# EAGLE design Display_LED (EAGLE 9.6.2)
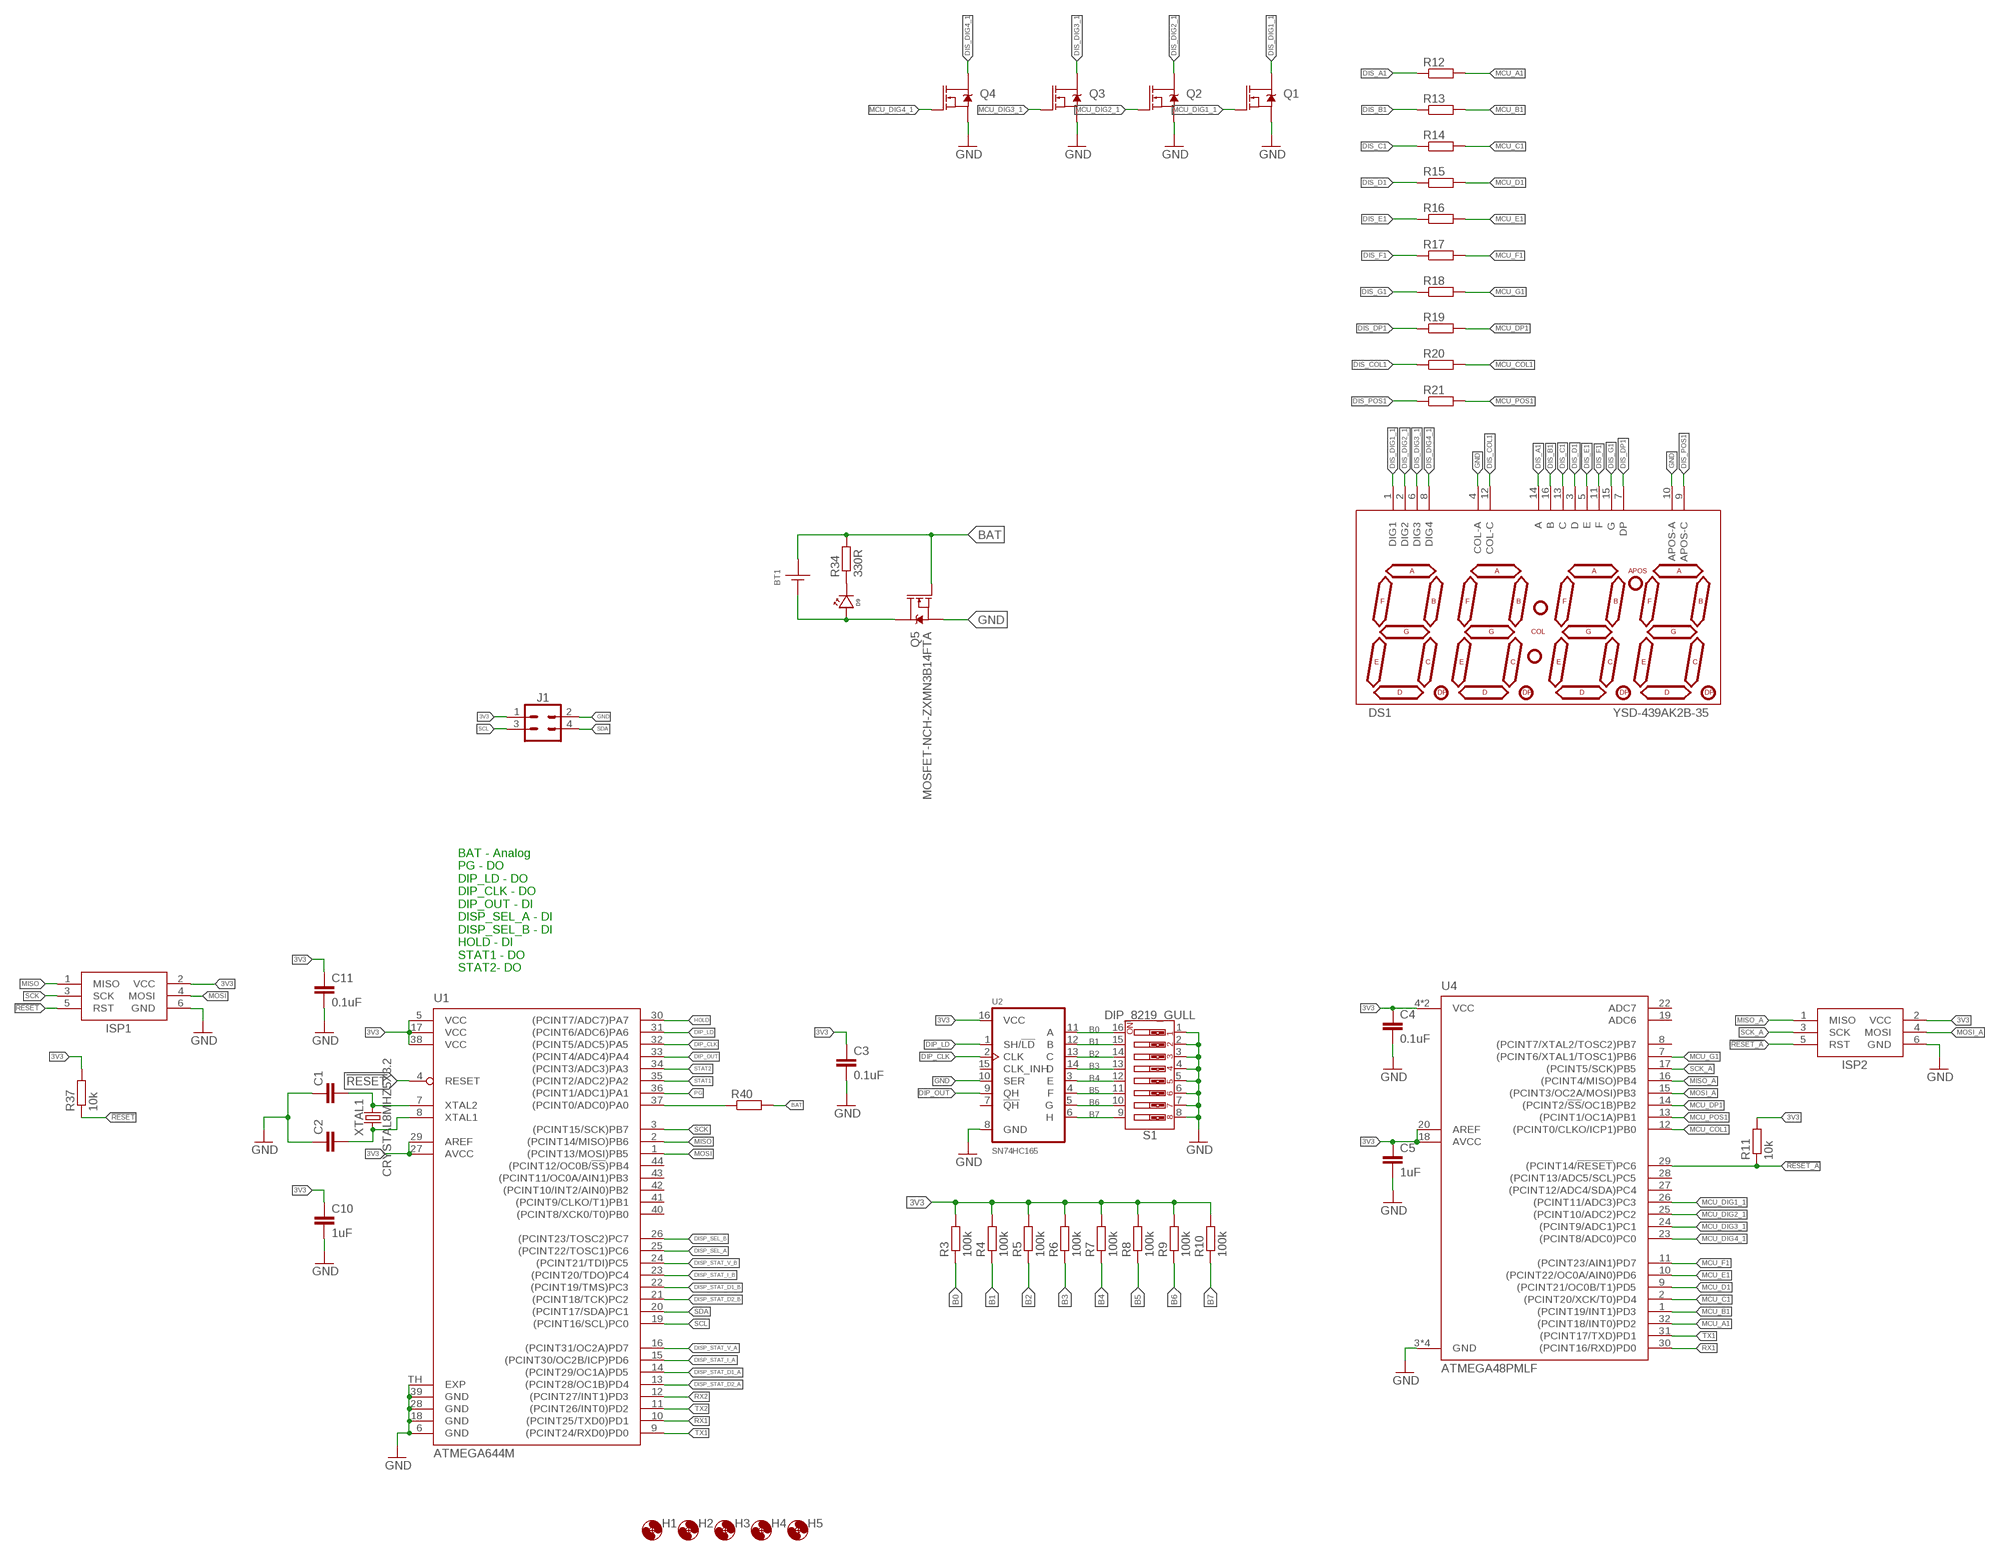
[diagram p0: schematic, sheet 1, part 1 of 2]
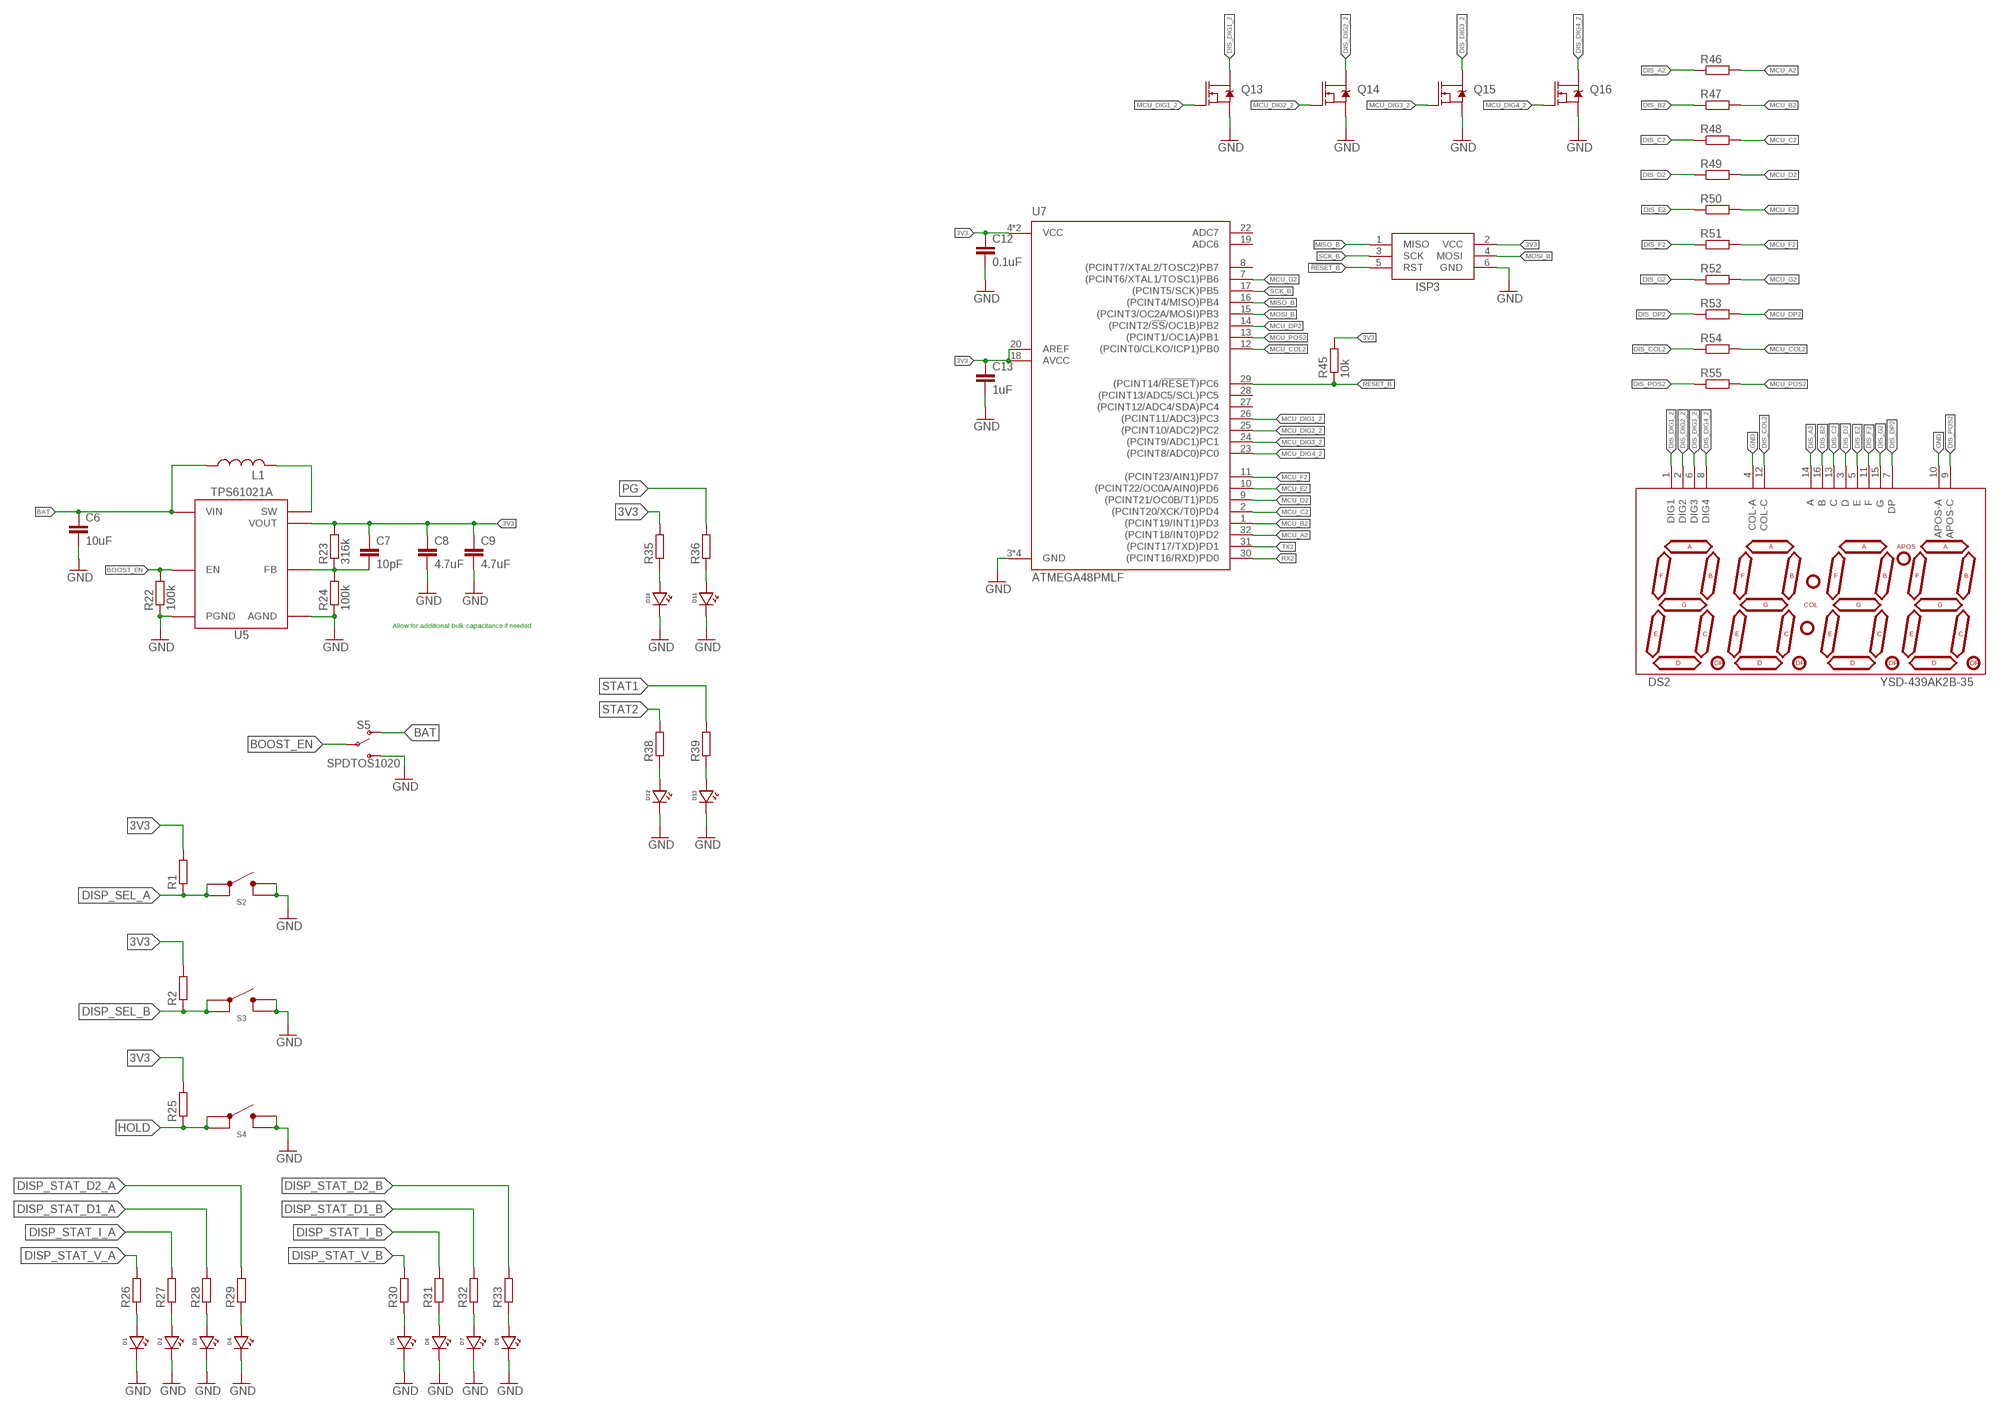
[diagram p1: schematic, sheet 1, part 2 of 2]

## Parts
BT1  AACLIP  [BAT_AA_BK-92]
C1  C-EU12PFC0402  [C0402]
C2  C-EU12PFC0402  [C0402]
C3  0.1uF  C-EU0.1UFC0603  [C0603]
C4  0.1uF  C-EU0.1UFC0603  [C0603]
C5  1uF  C-EU1UFC0603  [C0603]
C6  10uF  C-EU10UFC0805  [C0805]
C7  10pF  C-EU10PFC0603  [C0603]
C8  4.7uF  C-EU4.7UFC0805  [C0805]
C9  4.7uF  C-EU4.7UFC0805  [C0805]
C10  1uF  C-EU1UFC0603  [C0603]
C11  0.1uF  C-EU1UFC0603  [C0603]
C12  0.1uF  C-EU0.1UFC0603  [C0603]
C13  1uF  C-EU1UFC0603  [C0603]
D1  LED0603  [LED_0603]
D2  LED0603  [LED_0603]
D3  LED0603  [LED_0603]
D4  LED0603  [LED_0603]
D5  LED0603  [LED_0603]
D6  LED0603  [LED_0603]
D7  LED0603  [LED_0603]
D8  LED0603  [LED_0603]
D9  LED0603  [LED_0603]
D10  LED0603  [LED_0603]
D11  LED0603  [LED_0603]
D12  LED0603  [LED_0603]
D13  LED0603  [LED_0603]
DS1  YSD-439AK2B-35  LED_7-SEGMENT-4DIGIT-10MM-KGREEN  [7-SEGMENT-4DIGIT-YOUNGSUN]
DS2  YSD-439AK2B-35  LED_7-SEGMENT-4DIGIT-10MM-KGREEN  [7-SEGMENT-4DIGIT-YOUNGSUN]
H1  MOUNTING_HOLE2_NP  [2_56]
H2  MOUNTING_HOLE2_NP  [2_56]
H3  MOUNTING_HOLE2_NP  [2_56]
H4  MOUNTING_HOLE2_NP  [2_56]
H5  MOUNTING_HOLE2_NP  [2_56]
ISP1  AVRISP-6  [AVRISP]
ISP2  AVRISP-6  [AVRISP]
ISP3  AVRISP-6  [AVRISP]
J1  CONN_2X2MIRCOFIT_RT  [2X2_MICROFIT_RT]
L1  INDUCTORMAPI_3X3  [WE-MAPI(3X3)]
Q1  MOSFET-NCH-2N7002P  [SOT23-3]
Q2  MOSFET-NCH-2N7002P  [SOT23-3]
Q3  MOSFET-NCH-2N7002P  [SOT23-3]
Q4  MOSFET-NCH-2N7002P  [SOT23-3]
Q5  MOSFET-NCH-ZXMN3B14FTA  [SOT23-3]
Q13  MOSFET-NCH-2N7002P  [SOT23-3]
Q14  MOSFET-NCH-2N7002P  [SOT23-3]
Q15  MOSFET-NCH-2N7002P  [SOT23-3]
Q16  MOSFET-NCH-2N7002P  [SOT23-3]
R1  R-EU_10KR0603  [R0603]
R2  R-EU_10KR0603  [R0603]
R3  100k  R-EU_100KR0603  [R0603]
R4  100k  R-EU_100KR0603  [R0603]
R5  100k  R-EU_100KR0603  [R0603]
R6  100k  R-EU_100KR0603  [R0603]
R7  100k  R-EU_100KR0603  [R0603]
R8  100k  R-EU_100KR0603  [R0603]
R9  100k  R-EU_100KR0603  [R0603]
R10  100k  R-EU_100KR0603  [R0603]
R11  10k  R-EU_10KR0603  [R0603]
R12  R-EU_330R0603  [R0603]
R13  R-EU_330R0603  [R0603]
R14  R-EU_330R0603  [R0603]
R15  R-EU_330R0603  [R0603]
R16  R-EU_330R0603  [R0603]
R17  R-EU_330R0603  [R0603]
R18  R-EU_330R0603  [R0603]
R19  R-EU_330R0603  [R0603]
R20  R-EU_330R0603  [R0603]
R21  R-EU_330R0603  [R0603]
R22  100k  R-EU_100KR0603  [R0603]
R23  316k  R-EU_316KR0603  [R0603]
R24  100k  R-EU_100KR0603  [R0603]
R25  R-EU_10KR0603  [R0603]
R26  R-EU_330R0603  [R0603]
R27  R-EU_330R0603  [R0603]
R28  R-EU_330R0603  [R0603]
R29  R-EU_330R0603  [R0603]
R30  R-EU_330R0603  [R0603]
R31  R-EU_330R0603  [R0603]
R32  R-EU_330R0603  [R0603]
R33  R-EU_330R0603  [R0603]
R34  330R  R-EU_330R0603  [R0603]
R35  R-EU_330R0603  [R0603]
R36  R-EU_330R0603  [R0603]
R37  10k  R-EU_10KR0603  [R0603]
R38  R-EU_330R0603  [R0603]
R39  R-EU_330R0603  [R0603]
R40  R-EU_1KR0603  [R0603]
R45  10k  R-EU_10KR0603  [R0603]
R46  R-EU_330R0603  [R0603]
R47  R-EU_330R0603  [R0603]
R48  R-EU_330R0603  [R0603]
R49  R-EU_330R0603  [R0603]
R50  R-EU_330R0603  [R0603]
R51  R-EU_330R0603  [R0603]
R52  R-EU_330R0603  [R0603]
R53  R-EU_330R0603  [R0603]
R54  R-EU_330R0603  [R0603]
R55  R-EU_330R0603  [R0603]
S1  DIP_8219_GULL  [219-8_GULLWING_DIP-CTS]
S2  BUTTON6X6  [SWITCH_6MM]
S3  BUTTON6X6  [SWITCH_6MM]
S4  BUTTON6X6  [SWITCH_6MM]
S5  SPDTOS1020  [OS102011MS2QN1]
U1  ATMEGA644M  [MLF44-TH]
U2  SN74HC165PW  [TSSOP16]
U4  ATMEGA48PMLF  [MLF32-5X5]
U5  TPS61021A  [DSG0008A]
U7  ATMEGA48PMLF  [MLF32-5X5]
XTAL1  CRYSTAL8MHZ5X3.2  [CRYSTAL_5X3.2_2-SMD]

## Nets
3V3: C3.1 C4.1 C5.1 C7.1 C8.1 C9.1 C10.1 C11.1 C12.1 C13.1 ISP1.2(VCC) ISP2.2(VCC) ISP3.2(VCC) J1.1 R1.2 R2.2 R3.2 R4.2 R5.2 R6.2 R7.2 R8.2 R9.2 R10.2 R11.2 R23.2 R25.2 R35.2 R37.2 R45.2 U1.5(VCC) U1.17(VCC) U1.27(AVCC) U1.29(AREF) U1.38(VCC) U2.16(VCC) U4.4(VCC) U4.6(VCC) U4.18(AVCC) U4.20(AREF) U5.3(VOUT) U5.4(VOUT) U7.4(VCC) U7.6(VCC) U7.18(AVCC) U7.20(AREF)
!RESET: ISP1.5(RST) R37.1 U1.4(RESET)
!RESET_A: ISP2.5(RST) R11.1 U4.29((PCINT14/!RESET!)PC6)
!RESET_B: ISP3.5(RST) R45.1 U7.29((PCINT14/!RESET!)PC6)
B0: R3.1 S1.16 U2.11(A)
B1: R4.1 S1.15 U2.12(B)
B2: R5.1 S1.14 U2.13(C)
B3: R6.1 S1.13 U2.14(D)
B4: R7.1 S1.12 U2.3(E)
B5: R8.1 S1.11 U2.4(F)
B6: R9.1 S1.10 U2.5(G)
B7: R10.1 S1.9 U2.6(H)
BAT: BT1.POS@1(+) BT1.POS@2(+) C6.1 L1.P$1 Q5.1(G) R34.2 R40.2 S5.1(O) U5.8(VIN)
BAT_SENSE: R40.1 U1.37((PCINT0/ADC0)PA0)
BOOST_EN: R22.2 S5.2(P) U5.5(EN)
DIP_CLK: U1.32((PCINT5/ADC5)PA5) U2.2(CLK)
DIP_LD: U1.31((PCINT6/ADC6)PA6) U2.1(SH/!LD)
DIP_OUT: U1.33((PCINT4/ADC4)PA4) U2.9(QH)
DIS_A1: DS1.14(A) R12.1
DIS_A2: DS2.14(A) R46.1
DIS_B1: DS1.16(B) R13.1
DIS_B2: DS2.16(B) R47.1
DIS_C1: DS1.13(C) R14.1
DIS_C2: DS2.13(C) R48.1
DIS_COL1: DS1.12(COL-C) R20.1
DIS_COL2: DS2.12(COL-C) R54.1
DIS_D1: DS1.3(D) R15.1
DIS_D2: DS2.3(D) R49.1
DIS_DIG1_1: DS1.1(DIG1) Q1.3(D)
DIS_DIG1_2: DS2.1(DIG1) Q13.3(D)
DIS_DIG2_1: DS1.2(DIG2) Q2.3(D)
DIS_DIG2_2: DS2.2(DIG2) Q14.3(D)
DIS_DIG3_1: DS1.6(DIG3) Q3.3(D)
DIS_DIG3_2: DS2.6(DIG3) Q15.3(D)
DIS_DIG4_1: DS1.8(DIG4) Q4.3(D)
DIS_DIG4_2: DS2.8(DIG4) Q16.3(D)
DIS_DP1: DS1.7(DP) R19.1
DIS_DP2: DS2.7(DP) R53.1
DIS_E1: DS1.5(E) R16.1
DIS_E2: DS2.5(E) R50.1
DIS_F1: DS1.11(F) R17.1
DIS_F2: DS2.11(F) R51.1
DIS_G1: DS1.15(G) R18.1
DIS_G2: DS2.15(G) R52.1
DIS_POS1: DS1.9(APOS-C) R21.1
DIS_POS2: DS2.9(APOS-C) R55.1
DISP_SEL_A: R1.1 S2.1 S2.2 U1.25((PCINT22/TOSC1)PC6)
DISP_SEL_B: R2.1 S3.1 S3.2 U1.26((PCINT23/TOSC2)PC7)
DISP_STAT_D1_A: R28.2 U1.14((PCINT29/OC1A)PD5)
DISP_STAT_D1_B: R32.2 U1.22((PCINT19/TMS)PC3)
DISP_STAT_D2_A: R29.2 U1.13((PCINT28/OC1B)PD4)
DISP_STAT_D2_B: R33.2 U1.21((PCINT18/TCK)PC2)
DISP_STAT_I_A: R27.2 U1.15((PCINT30/OC2B/ICP)PD6)
DISP_STAT_I_B: R31.2 U1.23((PCINT20/TDO)PC4)
DISP_STAT_V_A: R26.2 U1.16((PCINT31/OC2A)PD7)
DISP_STAT_V_B: R30.2 U1.24((PCINT21/TDI)PC5)
FB: C7.2 R23.1 R24.2 U5.2(FB)
GND: C1.1 C2.1 C3.2 C4.2 C5.2 C6.2 C8.2 C9.2 C10.2 C11.2 C12.2 C13.2 D1.CATHODE D2.CATHODE D3.CATHODE D4.CATHODE D5.CATHODE D6.CATHODE D7.CATHODE D8.CATHODE D10.CATHODE D11.CATHODE D12.CATHODE D13.CATHODE DS1.4(COL-A) DS1.10(APOS-A) DS2.4(COL-A) DS2.10(APOS-A) ISP1.6(GND) ISP2.6(GND) ISP3.6(GND) J1.2 Q1.2(S) Q2.2(S) Q3.2(S) Q4.2(S) Q5.2(S) Q13.2(S) Q14.2(S) Q15.2(S) Q16.2(S) R22.1 R24.1 S1.1 S1.2 S1.3 S1.4 S1.5 S1.6 S1.7 S1.8 S2.3 S2.4 S3.3 S3.4 S4.3 S4.4 S5.3(S) U1.6(GND) U1.18(GND) U1.28(GND) U1.39(GND) U1.TH(EXP) U2.8(GND) U2.10(SER) U4.3(GND) U4.5(GND) U4.21(GND) U4.TH(GND) U5.1(AGND) U5.EP@1(PGND) U5.EP@2(PGND) U5.EP@3(PGND) U7.3(GND) U7.5(GND) U7.21(GND) U7.TH(GND)
HOLD: R25.1 S4.1 S4.2 U1.30((PCINT7/ADC7)PA7)
MCU_A1: R12.2 U4.32((PCINT18/INT0)PD2)
MCU_A2: R46.2 U7.32((PCINT18/INT0)PD2)
MCU_B1: R13.2 U4.1((PCINT19/INT1)PD3)
MCU_B2: R47.2 U7.1((PCINT19/INT1)PD3)
MCU_C1: R14.2 U4.2((PCINT20/XCK/T0)PD4)
MCU_C2: R48.2 U7.2((PCINT20/XCK/T0)PD4)
MCU_COL1: R20.2 U4.12((PCINT0/CLKO/ICP1)PB0)
MCU_COL2: R54.2 U7.12((PCINT0/CLKO/ICP1)PB0)
MCU_D1: R15.2 U4.9((PCINT21/OC0B/T1)PD5)
MCU_D2: R49.2 U7.9((PCINT21/OC0B/T1)PD5)
MCU_DIG1_1: Q1.1(G) U4.26((PCINT11/ADC3)PC3)
MCU_DIG1_2: Q13.1(G) U7.26((PCINT11/ADC3)PC3)
MCU_DIG2_1: Q2.1(G) U4.25((PCINT10/ADC2)PC2)
MCU_DIG2_2: Q14.1(G) U7.25((PCINT10/ADC2)PC2)
MCU_DIG3_1: Q3.1(G) U4.24((PCINT9/ADC1)PC1)
MCU_DIG3_2: Q15.1(G) U7.24((PCINT9/ADC1)PC1)
MCU_DIG4_1: Q4.1(G) U4.23((PCINT8/ADC0)PC0)
MCU_DIG4_2: Q16.1(G) U7.23((PCINT8/ADC0)PC0)
MCU_DP1: R19.2 U4.14((PCINT2/!SS!/OC1B)PB2)
MCU_DP2: R53.2 U7.14((PCINT2/!SS!/OC1B)PB2)
MCU_E1: R16.2 U4.10((PCINT22/OC0A/AIN0)PD6)
MCU_E2: R50.2 U7.10((PCINT22/OC0A/AIN0)PD6)
MCU_F1: R17.2 U4.11((PCINT23/AIN1)PD7)
MCU_F2: R51.2 U7.11((PCINT23/AIN1)PD7)
MCU_G1: R18.2 U4.7((PCINT6/XTAL1/TOSC1)PB6)
MCU_G2: R52.2 U7.7((PCINT6/XTAL1/TOSC1)PB6)
MCU_POS1: R21.2 U4.13((PCINT1/OC1A)PB1)
MCU_POS2: R55.2 U7.13((PCINT1/OC1A)PB1)
MISO: ISP1.1(MISO) U1.2((PCINT14/MISO)PB6)
MISO_A: ISP2.1(MISO) U4.16((PCINT4/MISO)PB4)
MISO_B: ISP3.1(MISO) U7.16((PCINT4/MISO)PB4)
MOSI: ISP1.4(MOSI) U1.1((PCINT13/MOSI)PB5)
MOSI_A: ISP2.4(MOSI) U4.15((PCINT3/OC2A/MOSI)PB3)
MOSI_B: ISP3.4(MOSI) U7.15((PCINT3/OC2A/MOSI)PB3)
N$1: D1.ANODE R26.1
N$2: D2.ANODE R27.1
N$3: D3.ANODE R28.1
N$4: D4.ANODE R29.1
N$5: D5.ANODE R30.1
N$6: D6.ANODE R31.1
N$7: D7.ANODE R32.1
N$8: D8.ANODE R33.1
N$9: D10.ANODE R35.1
N$10: BT1.NEG@1(-) BT1.NEG@2(-) D9.ANODE Q5.3(D)
N$11: D9.CATHODE R34.1
N$12: D12.ANODE R38.1
N$13: C2.2 U1.8(XTAL1) XTAL1.OSC1
N$14: D11.ANODE R36.1
N$15: C1.2 U1.7(XTAL2) XTAL1.OSC2
N$16: D13.ANODE R39.1
PG: R36.2 U1.36((PCINT1/ADC1)PA1)
RX1: U1.10((PCINT25/TXD0)PD1) U4.30((PCINT16/RXD)PD0)
RX2: U1.12((PCINT27/INT1)PD3) U7.30((PCINT16/RXD)PD0)
SCK: ISP1.3(SCK) U1.3((PCINT15/SCK)PB7)
SCK_A: ISP2.3(SCK) U4.17((PCINT5/SCK)PB5)
SCK_B: ISP3.3(SCK) U7.17((PCINT5/SCK)PB5)
SCL: J1.3 U1.19((PCINT16/SCL)PC0)
SDA: J1.4 U1.20((PCINT17/SDA)PC1)
STAT1: R39.2 U1.35((PCINT2/ADC2)PA2)
STAT2: R38.2 U1.34((PCINT3/ADC3)PA3)
SW: L1.P$2 U5.6(SW) U5.7(SW)
TX1: U1.9((PCINT24/RXD0)PD0) U4.31((PCINT17/TXD)PD1)
TX2: U1.11((PCINT26/INT0)PD2) U7.31((PCINT17/TXD)PD1)
Unconnected: U1.40((PCINT8/XCK0/T0)PB0) U1.41((PCINT9/CLKO/T1)PB1) U1.42((PCINT10/INT2/AIN0)PB2) U1.43((PCINT11/OC0A/AIN1)PB3) U1.44((PCINT12/OC0B/!SS!)PB4) U2.7(!QH) U2.15(CLK_INH) U4.8((PCINT7/XTAL2/TOSC2)PB7) U4.19(ADC6) U4.22(ADC7) U4.27((PCINT12/ADC4/SDA)PC4) U4.28((PCINT13/ADC5/SCL)PC5) U7.8((PCINT7/XTAL2/TOSC2)PB7) U7.19(ADC6) U7.22(ADC7) U7.27((PCINT12/ADC4/SDA)PC4) U7.28((PCINT13/ADC5/SCL)PC5)

## Notes on the sheet
- Allow for additional bulk capacitance if needed
- BAT - Analog
  PG - DO
  DIP_LD - DO
  DIP_CLK - DO
  DIP_OUT - DI
  DISP_SEL_A - DI
  DISP_SEL_B - DI
  HOLD - DI
  STAT1 - DO
  STAT2- DO

## Library data of the parts
BT1 = bschulz:AA: AA Battery Holder/Contact; DIGIKEY: BK-92-ND; MF: MPD; MPN: BK-92
C1 C2 = bschulz_passives:C-EU: CAPACITOR, European symbol; DIGIKEY: 445-5585-1-ND; MF: TDK; MPN: CGA2B2C0G1H120J050BA
C3 C4 C12 = bschulz_passives:C-EU: CAPACITOR, European symbol; DIGIKEY: 490-6051-1-ND; MF: Murata; MPN: GCM188R71E104KA57D
C5 C10 C11 C13 = bschulz_passives:C-EU: CAPACITOR, European symbol; DIGIKEY: 587-1251-1-ND; MF: Yaiyo Yuden; MPN: EMK107BJ105KA-T
C6 = bschulz_passives:C-EU: CAPACITOR, European symbol; DIGIKEY: 490-6473-6-ND; MF: Murata; MPN: GRM21BR61C106KE15K
C7 = bschulz_passives:C-EU: CAPACITOR, European symbol; DIGIKEY: 311-1058-1-ND; MF: Yageo; MPN: CC0603JRNPO9BN100CC0603JRNPO9BN100
C8 C9 = bschulz_passives:C-EU: CAPACITOR, European symbol; DIGIKEY: 399-7415-1-ND; MF: Kemet; MPN: C0805C475K4RACTU
D1-D13 = bschulz:LED: Genaric LED
DS1 DS2 = bschulz:LED_7-SEGMENT-4DIGIT-10MM: 4 Digit 7 Segment Display This is a part for the 4-Digit 7-segment LEDs from Young Sun. Different from the Digikey LEDs, all 16 pins are used. The LONGPADS Variant is used for a test jig, but you may like it because there is more pad to solder to. If you are concerned about routing space, the standard works just fine though. Datasheets: Red <http://www.sparkfun.com/datasheets/Components/LED/7-Segment/YSD-439AR6B-35.pdf> Yellow <http://www.sparkfun.com/datasheets/Components/LED/7-Segment/YSD-439AY2B-35.pdf> Kelly Green <http://www.sparkfun.com/datasheets/Components/LED/7-Segment/YSD-439AK2B-35.pdf> Blue <http://www.sparkfun.com/datasheets/Components/LED/7-Segment/YSD-439AB4B-35.pdf> White <http://cdn.sparkfun.com/datasheets/Components/LED/ATA3492BW_2.pdf> SparkFun Products Raw Components 7-Segment Display - 4-Digit (Red) <https://www.sparkfun.com/products/9483> (COM-09483) 7-Segment Display - 4-Digit (Yellow) <https://www.sparkfun.com/products/9480> (COM-09480) 7-Segment Display - 4-Digit (Kelly Green) <https://www.sparkfun.com/products/9482> (COM-09482) 7-Segment Display - 4-Digit (Blue) <https://www.sparkfun.com/products/9481> (COM-09481) 7-Segment Display - 4-Digit (White) <https://www.sparkfun.com/products/10931> ( COM-10931) Serial Controlled SparkFun 7-Segment Serial Display - Red <https://www.sparkfun.com/products/11441> (COM-11441) SparkFun 7-Segment Serial Display - Yellow <https://www.sparkfun.com/products/11443> (COM-11443) SparkFun 7-Segment Serial Display - Kelly Green <https://www.sparkfun.com/products/11440> (COM-11440) SparkFun 7-Segment Serial Display - Blue <https://www.sparkfun.com/products/11442> (COM-11442) SparkFun 7-Segment Serial Display - White <https://www.sparkfun.com/products/11629> (COM-11629) Other SparkFun BigTime Watch Kit <https://www.sparkfun.com/products/11734> (KIT-11734); PROD_ID: COMP-09665
H1-H5 = bschulz:MOUNTING_HOLE: Genaric Mechanical Mounting Hole Hole diameter based on max body diameter + 15% Keepout ring is for diameter of socket cap screw (minimum required clearance) TPlace ring is for diameter of pan head screw (recomended clearance) Specifications: Socket Cap <http://fastener-express.com/fastener-technical/SocketscapSS-Alloy.pdf> Button Head Socket Cap <http://fastener-express.com/fastener-technical/Button-Socket-alloy.pdf> Pan Head <http://fastener-express.com/fastener-technical/pan-machine-Screws.pdf>; DIGIKEY: DNP; MF: N/A; MPN: DNP
ISP1-ISP3 = bschulz:AVRISP: AVR ISP HEADER Standard 6 pin header for AVR programming
J1 = bschulz:CONN_2X2: Genaric 2x2 terminal header; DIGIKEY: WM1814-ND; MF: Molex; MPN: 0430450400
L1 = bschulz:INDUCTOR: Genaric inductor
Q1-Q4 Q13-Q16 = bschulz:MOSFET-NCH: N-channel MOSFETs Voltage controlled devices that allow control of high current outputs. SparkFun Products: SparkFun OpenScale <https://www.sparkfun.com/products/13261> SparkFun Digital Sandbox <https://www.sparkfun.com/products/12651> SparkFun Monster Moto Shield <https://www.sparkfun.com/products/10182> SparkFun MOSFET Power Controller <https://www.sparkfun.com/products/11214>; DIGIKEY: 1727-4692-1-ND; MF: Nexperia; MPN: 2N7002P,215
Q5 = bschulz:MOSFET-NCH: N-channel MOSFETs Voltage controlled devices that allow control of high current outputs. SparkFun Products: SparkFun OpenScale <https://www.sparkfun.com/products/13261> SparkFun Digital Sandbox <https://www.sparkfun.com/products/12651> SparkFun Monster Moto Shield <https://www.sparkfun.com/products/10182> SparkFun MOSFET Power Controller <https://www.sparkfun.com/products/11214>; DIGIKEY: ZXMN3B14FCT-ND; MF: Diodes Inc; MPN: ZXMN3B14FTA
R1 R2 R11 R25 R37 R45 = bschulz_passives:R-EU_: RESISTOR, European symbol Digikey Parts: Yageo, 0402 <https://www.digikey.com/products/en/resistors/chip-resistor-surface-mount/52?k=&pkeyword=&sv=0&s=4356&sf=1&FV=-1%7C13%2C7%7C2%2C1291%7C39157%2C1989%7C0%2C-8%7C52%2C3%7C1131%2C3%7C2503&quantity=&ColumnSort=0&page=1&stock=1&pageSize=25> Yageo, 0603 <https://www.digikey.com/products/en/resistors/chip-resistor-surface-mount/52?k=&pkeyword=&sv=0&pv1291=39245&sf=1&FV=-5%7C4356%2C-5%7C47360%2C-8%7C52%2C-1%7C13%2C7%7C2%2C1989%7C0&quantity=10&ColumnSort=1000011&page=1&stock=1&pageSize=25> Panasonic, 0603 <https://www.digikey.com/products/en/resistors/chip-resistor-surface-mount/52?k=&pkeyword=&pv252=68&sf=0&FV=ffec373d%2C1c0002%2C142c040c%2C1f140000%2Cffe00034%2C80002%2Cc0001&quantity=&ColumnSort=0&page=1&stock=1&pageSize=25> Panasonic, precision, 0603 <https://www.digikey.com/products/en/resistors/chip-resistor-surface-mount/52?FV=ffec4907%2Cfffc000a%2Cc0172%2C142c040c%2C1f140000%2Cffe00034%2C1c0002&quantity=100&ColumnSort=2085&page=1&stock=1&pageSize=25> Panasonic, 0805 <https://www.digikey.com/products/en/resistors/chip-resistor-surface-mount/52?k=&pkeyword=&pv3=1&sf=0&FV=ffec373d%2C1c0002%2C1f140000%2Cffe00034%2C142c040d&quantity=&ColumnSort=0&page=1&stock=1&pageSize=25> Rohm, current sense <https://www.digikey.com/products/en/resistors/chip-resistor-surface-mount/52?k=&pkeyword=&pv3=1&sf=0&FV=ffecb688%2C1f140000%2Cffe00034%2C1c0002&quantity=&ColumnSort=0&page=1&stock=1&pageSize=25> Vishay, pulse proof automotive <https://www.digikey.com/products/en/resistors/chip-resistor-surface-mount/52?k=&pkeyword=&pv7=2&sf=0&FV=ffec5d6b%2Cffe00034%2C1f140000&quantity=&ColumnSort=0&page=1&stock=1&pageSize=25>; DIGIKEY: 311-10.0KHRCT-ND; MF: Yageo; MPN: RC0603FR-0710KL; VALUE_PART: 10k
R3-R10 R22 R24 = bschulz_passives:R-EU_: RESISTOR, European symbol Digikey Parts: Yageo, 0402 <https://www.digikey.com/products/en/resistors/chip-resistor-surface-mount/52?k=&pkeyword=&sv=0&s=4356&sf=1&FV=-1%7C13%2C7%7C2%2C1291%7C39157%2C1989%7C0%2C-8%7C52%2C3%7C1131%2C3%7C2503&quantity=&ColumnSort=0&page=1&stock=1&pageSize=25> Yageo, 0603 <https://www.digikey.com/products/en/resistors/chip-resistor-surface-mount/52?k=&pkeyword=&sv=0&pv1291=39245&sf=1&FV=-5%7C4356%2C-5%7C47360%2C-8%7C52%2C-1%7C13%2C7%7C2%2C1989%7C0&quantity=10&ColumnSort=1000011&page=1&stock=1&pageSize=25> Panasonic, 0603 <https://www.digikey.com/products/en/resistors/chip-resistor-surface-mount/52?k=&pkeyword=&pv252=68&sf=0&FV=ffec373d%2C1c0002%2C142c040c%2C1f140000%2Cffe00034%2C80002%2Cc0001&quantity=&ColumnSort=0&page=1&stock=1&pageSize=25> Panasonic, precision, 0603 <https://www.digikey.com/products/en/resistors/chip-resistor-surface-mount/52?FV=ffec4907%2Cfffc000a%2Cc0172%2C142c040c%2C1f140000%2Cffe00034%2C1c0002&quantity=100&ColumnSort=2085&page=1&stock=1&pageSize=25> Panasonic, 0805 <https://www.digikey.com/products/en/resistors/chip-resistor-surface-mount/52?k=&pkeyword=&pv3=1&sf=0&FV=ffec373d%2C1c0002%2C1f140000%2Cffe00034%2C142c040d&quantity=&ColumnSort=0&page=1&stock=1&pageSize=25> Rohm, current sense <https://www.digikey.com/products/en/resistors/chip-resistor-surface-mount/52?k=&pkeyword=&pv3=1&sf=0&FV=ffecb688%2C1f140000%2Cffe00034%2C1c0002&quantity=&ColumnSort=0&page=1&stock=1&pageSize=25> Vishay, pulse proof automotive <https://www.digikey.com/products/en/resistors/chip-resistor-surface-mount/52?k=&pkeyword=&pv7=2&sf=0&FV=ffec5d6b%2Cffe00034%2C1f140000&quantity=&ColumnSort=0&page=1&stock=1&pageSize=25>; DIGIKEY: 311-100KHRCT-ND; MF: Yageo; MPN: RC0603FR-07100KL; VALUE_PART: 100k
R12-R21 R26-R36 R38 R39 R46-R55 = bschulz_passives:R-EU_: RESISTOR, European symbol Digikey Parts: Yageo, 0402 <https://www.digikey.com/products/en/resistors/chip-resistor-surface-mount/52?k=&pkeyword=&sv=0&s=4356&sf=1&FV=-1%7C13%2C7%7C2%2C1291%7C39157%2C1989%7C0%2C-8%7C52%2C3%7C1131%2C3%7C2503&quantity=&ColumnSort=0&page=1&stock=1&pageSize=25> Yageo, 0603 <https://www.digikey.com/products/en/resistors/chip-resistor-surface-mount/52?k=&pkeyword=&sv=0&pv1291=39245&sf=1&FV=-5%7C4356%2C-5%7C47360%2C-8%7C52%2C-1%7C13%2C7%7C2%2C1989%7C0&quantity=10&ColumnSort=1000011&page=1&stock=1&pageSize=25> Panasonic, 0603 <https://www.digikey.com/products/en/resistors/chip-resistor-surface-mount/52?k=&pkeyword=&pv252=68&sf=0&FV=ffec373d%2C1c0002%2C142c040c%2C1f140000%2Cffe00034%2C80002%2Cc0001&quantity=&ColumnSort=0&page=1&stock=1&pageSize=25> Panasonic, precision, 0603 <https://www.digikey.com/products/en/resistors/chip-resistor-surface-mount/52?FV=ffec4907%2Cfffc000a%2Cc0172%2C142c040c%2C1f140000%2Cffe00034%2C1c0002&quantity=100&ColumnSort=2085&page=1&stock=1&pageSize=25> Panasonic, 0805 <https://www.digikey.com/products/en/resistors/chip-resistor-surface-mount/52?k=&pkeyword=&pv3=1&sf=0&FV=ffec373d%2C1c0002%2C1f140000%2Cffe00034%2C142c040d&quantity=&ColumnSort=0&page=1&stock=1&pageSize=25> Rohm, current sense <https://www.digikey.com/products/en/resistors/chip-resistor-surface-mount/52?k=&pkeyword=&pv3=1&sf=0&FV=ffecb688%2C1f140000%2Cffe00034%2C1c0002&quantity=&ColumnSort=0&page=1&stock=1&pageSize=25> Vishay, pulse proof automotive <https://www.digikey.com/products/en/resistors/chip-resistor-surface-mount/52?k=&pkeyword=&pv7=2&sf=0&FV=ffec5d6b%2Cffe00034%2C1f140000&quantity=&ColumnSort=0&page=1&stock=1&pageSize=25>; DIGIKEY: 311-330HRCT-ND; MF: Yageo; MPN: RC0603FR-07330RL; VALUE_PART: 330
R23 = bschulz_passives:R-EU_: RESISTOR, European symbol Digikey Parts: Yageo, 0402 <https://www.digikey.com/products/en/resistors/chip-resistor-surface-mount/52?k=&pkeyword=&sv=0&s=4356&sf=1&FV=-1%7C13%2C7%7C2%2C1291%7C39157%2C1989%7C0%2C-8%7C52%2C3%7C1131%2C3%7C2503&quantity=&ColumnSort=0&page=1&stock=1&pageSize=25> Yageo, 0603 <https://www.digikey.com/products/en/resistors/chip-resistor-surface-mount/52?k=&pkeyword=&sv=0&pv1291=39245&sf=1&FV=-5%7C4356%2C-5%7C47360%2C-8%7C52%2C-1%7C13%2C7%7C2%2C1989%7C0&quantity=10&ColumnSort=1000011&page=1&stock=1&pageSize=25> Panasonic, 0603 <https://www.digikey.com/products/en/resistors/chip-resistor-surface-mount/52?k=&pkeyword=&pv252=68&sf=0&FV=ffec373d%2C1c0002%2C142c040c%2C1f140000%2Cffe00034%2C80002%2Cc0001&quantity=&ColumnSort=0&page=1&stock=1&pageSize=25> Panasonic, precision, 0603 <https://www.digikey.com/products/en/resistors/chip-resistor-surface-mount/52?FV=ffec4907%2Cfffc000a%2Cc0172%2C142c040c%2C1f140000%2Cffe00034%2C1c0002&quantity=100&ColumnSort=2085&page=1&stock=1&pageSize=25> Panasonic, 0805 <https://www.digikey.com/products/en/resistors/chip-resistor-surface-mount/52?k=&pkeyword=&pv3=1&sf=0&FV=ffec373d%2C1c0002%2C1f140000%2Cffe00034%2C142c040d&quantity=&ColumnSort=0&page=1&stock=1&pageSize=25> Rohm, current sense <https://www.digikey.com/products/en/resistors/chip-resistor-surface-mount/52?k=&pkeyword=&pv3=1&sf=0&FV=ffecb688%2C1f140000%2Cffe00034%2C1c0002&quantity=&ColumnSort=0&page=1&stock=1&pageSize=25> Vishay, pulse proof automotive <https://www.digikey.com/products/en/resistors/chip-resistor-surface-mount/52?k=&pkeyword=&pv7=2&sf=0&FV=ffec5d6b%2Cffe00034%2C1f140000&quantity=&ColumnSort=0&page=1&stock=1&pageSize=25>; DIGIKEY: 311-316KHRCT-ND; MF: Yageo; MPN: RC0603FR-07316KL; VALUE_PART: 316k
R40 = bschulz_passives:R-EU_: RESISTOR, European symbol Digikey Parts: Yageo, 0402 <https://www.digikey.com/products/en/resistors/chip-resistor-surface-mount/52?k=&pkeyword=&sv=0&s=4356&sf=1&FV=-1%7C13%2C7%7C2%2C1291%7C39157%2C1989%7C0%2C-8%7C52%2C3%7C1131%2C3%7C2503&quantity=&ColumnSort=0&page=1&stock=1&pageSize=25> Yageo, 0603 <https://www.digikey.com/products/en/resistors/chip-resistor-surface-mount/52?k=&pkeyword=&sv=0&pv1291=39245&sf=1&FV=-5%7C4356%2C-5%7C47360%2C-8%7C52%2C-1%7C13%2C7%7C2%2C1989%7C0&quantity=10&ColumnSort=1000011&page=1&stock=1&pageSize=25> Panasonic, 0603 <https://www.digikey.com/products/en/resistors/chip-resistor-surface-mount/52?k=&pkeyword=&pv252=68&sf=0&FV=ffec373d%2C1c0002%2C142c040c%2C1f140000%2Cffe00034%2C80002%2Cc0001&quantity=&ColumnSort=0&page=1&stock=1&pageSize=25> Panasonic, precision, 0603 <https://www.digikey.com/products/en/resistors/chip-resistor-surface-mount/52?FV=ffec4907%2Cfffc000a%2Cc0172%2C142c040c%2C1f140000%2Cffe00034%2C1c0002&quantity=100&ColumnSort=2085&page=1&stock=1&pageSize=25> Panasonic, 0805 <https://www.digikey.com/products/en/resistors/chip-resistor-surface-mount/52?k=&pkeyword=&pv3=1&sf=0&FV=ffec373d%2C1c0002%2C1f140000%2Cffe00034%2C142c040d&quantity=&ColumnSort=0&page=1&stock=1&pageSize=25> Rohm, current sense <https://www.digikey.com/products/en/resistors/chip-resistor-surface-mount/52?k=&pkeyword=&pv3=1&sf=0&FV=ffecb688%2C1f140000%2Cffe00034%2C1c0002&quantity=&ColumnSort=0&page=1&stock=1&pageSize=25> Vishay, pulse proof automotive <https://www.digikey.com/products/en/resistors/chip-resistor-surface-mount/52?k=&pkeyword=&pv7=2&sf=0&FV=ffec5d6b%2Cffe00034%2C1f140000&quantity=&ColumnSort=0&page=1&stock=1&pageSize=25>; DIGIKEY: 311-1KLDCT-ND; MF: Yageo; MPN: AC0603FR-071KL; VALUE_PART: 1k
S1 = bschulz:DIP_8: DIP Switch, 8 Pos; DIGIKEY: CT3121CT-ND; MF: CTS; MPN: 219-8MSTR
S2-S4 = bschulz:BUTTON: Genaric SPST Push button
S5 = bschulz:SPDT: Genaric SPDT switch
U1 = bschulz:ATMEGA644*: 8-bit Microcontroller with 64K Bytes In-System Programmable Flash Source: http://www.atmel.com/dyn/resources/prod_documents/doc2593.pdf; DIGIKEY: ATMEGA644PA-MURCT-ND; MF: Atmel; MPN: ATMEGA644PA-MUR; OC_FARNELL: 1748528; OC_NEWARK: 26R5636
U2 = bschulz:SN74HC165: SN74HC165 - 8 bit PISO shift register Characteristics: VCC: 2~6V Operating Temperature: -40°C to 85°C fmax = 2.5 MHz (for Vcc = 2v, high for higher Vcc) Digikey: 296-8253-1-ND (TSSOP) <https://www.digikey.com/product-detail/en/texas-instruments/SN74HC165PWR/296-8253-1-ND/376670> 296-8250-1-ND (SOIC) <https://www.digikey.com/product-detail/en/texas-instruments/SN74HC165DR/296-8250-1-ND/405259> 296-8251-5-ND (DIP) <https://www.digikey.com/product-detail/en/texas-instruments/SN74HC165N/296-8251-5-ND/376966>; DIGIKEY: 296-8253-1-ND; MF: TI; MPN: SN74HC165PWR
U4 U7 = bschulz:ATMEGA48P: ATmega48P/88P/168P 8 bit AVR Microcontroller Features: (441/841) Vcc: 2.7 ~ 5.5V (P) or 1.8 ~ 5.5V (PV) Clock: Up to 20MHz, Internal 8MHz FRC, 32kHz RC Flash Memory: 4/8/16K SRAM: 512/1K/1K B EEPROM: 256/512/512B ADC: 10b, 8 port USART: Yes SPI: Yes I2C: Yes Digikey: ATMEGA48PA-AUR (TQFP-32) <https://www.digikey.com/en/products/detail/microchip-technology/ATMEGA48PA-AUR/2357144> ATMEGA48PA-MNR (MLF-32) <https://www.digikey.com/en/products/detail/microchip-technology/ATMEGA48PA-MNR/2522758> ATMEGA88PA-AUR (TQFP-32) <https://www.digikey.com/en/products/detail/microchip-technology/ATMEGA88PA-AUR/2357263> ATMEGA88PA-MNR (MLF-32) <https://www.digikey.com/en/products/detail/microchip-technology/ATMEGA88PA-MNR/2522767>; DIGIKEY: ATMEGA48PA-MNRCT-ND; MF: Microchip; MPN: ATMEGA48PA-MNR
U5 = bschulz:TPS61021A: TPS61021A - Boost Converter with Ultra Low Input Voltage Characteristics: Vin: 0.5V ~ 4.4V Vout: 1.8V ~ 4.0V (Fixed options available) Output Current: 1.5 A (if Vout = 3.3V, Vin > 1.8V) 1A (if Vout = 3.3V, Vin > 1.2V) IQ: ~20μA ISD: 0.5μA Operating Temperature: -40°C to 85°C Digikey: 296-46241-1-ND <https://www.digikey.com/en/products/detail/texas-instruments/TPS61021ADSGT/6572480>; DIGIKEY: 296-46241-1-ND; MF: TI; MPN: TPS61021ADSGT
XTAL1 = bschulz:CRYSTAL: Crystal Oscilator 2 Pin quartz crystal oscilators Variants 3.2x1.5mm (Only available in 32.768kHz) <https://www.digikey.com/products/en/crystals-oscillators-resonators/crystals/171?FV=b839bf%2Cb83a33%2C8640001%2C864000f%2C8640003%2C1f140000%2Cmu32.768kHz%7C2150%2Cffe000ab&quantity=10&ColumnSort=1000011&page=1&stock=1&k=crystal&pageSize=25&pkeyword=crystal> 5 x 3.2mm (8MHz ~ 50MHz) <https://www.digikey.com/products/en/crystals-oscillators-resonators/crystals/171?FV=402f3e%2Cb8434d%2C1f140000%2Cffe000ab&quantity=10&ColumnSort=1000011&page=1&stock=1&pageSize=25>; DIGIKEY: 887-1740-1-ND; MF: TXC; MPN: 7A-8.000MAAE-T

## Board
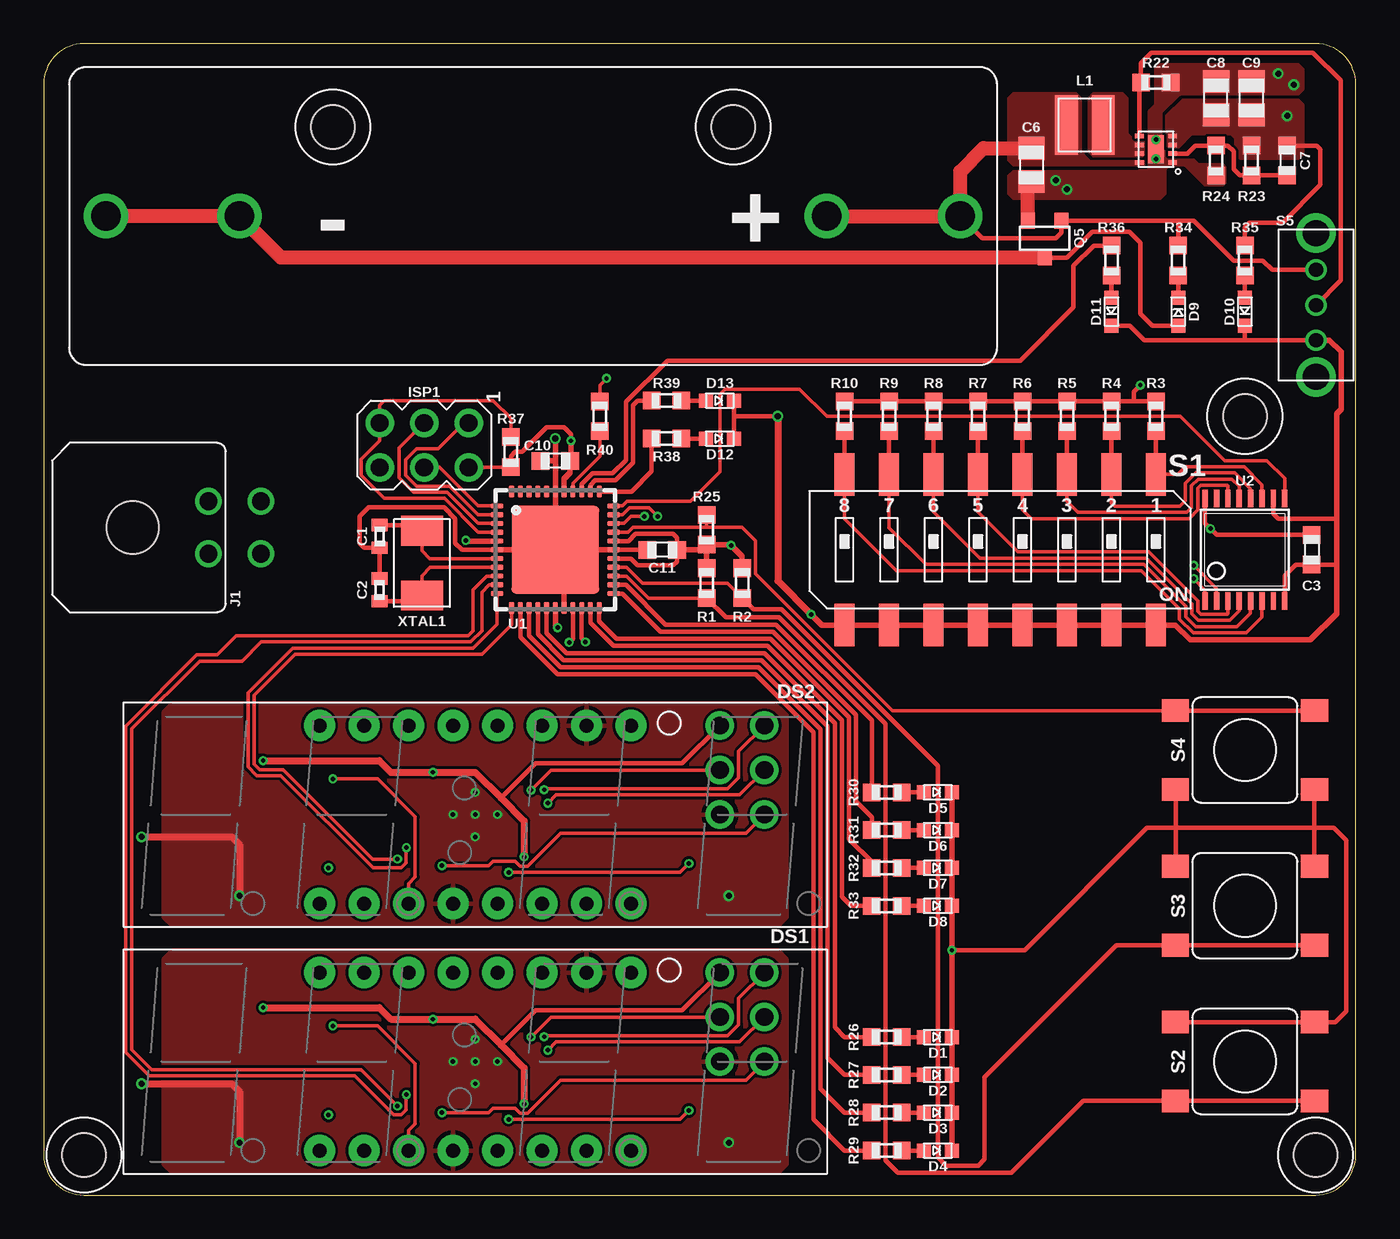
[diagram p2: board, top side]
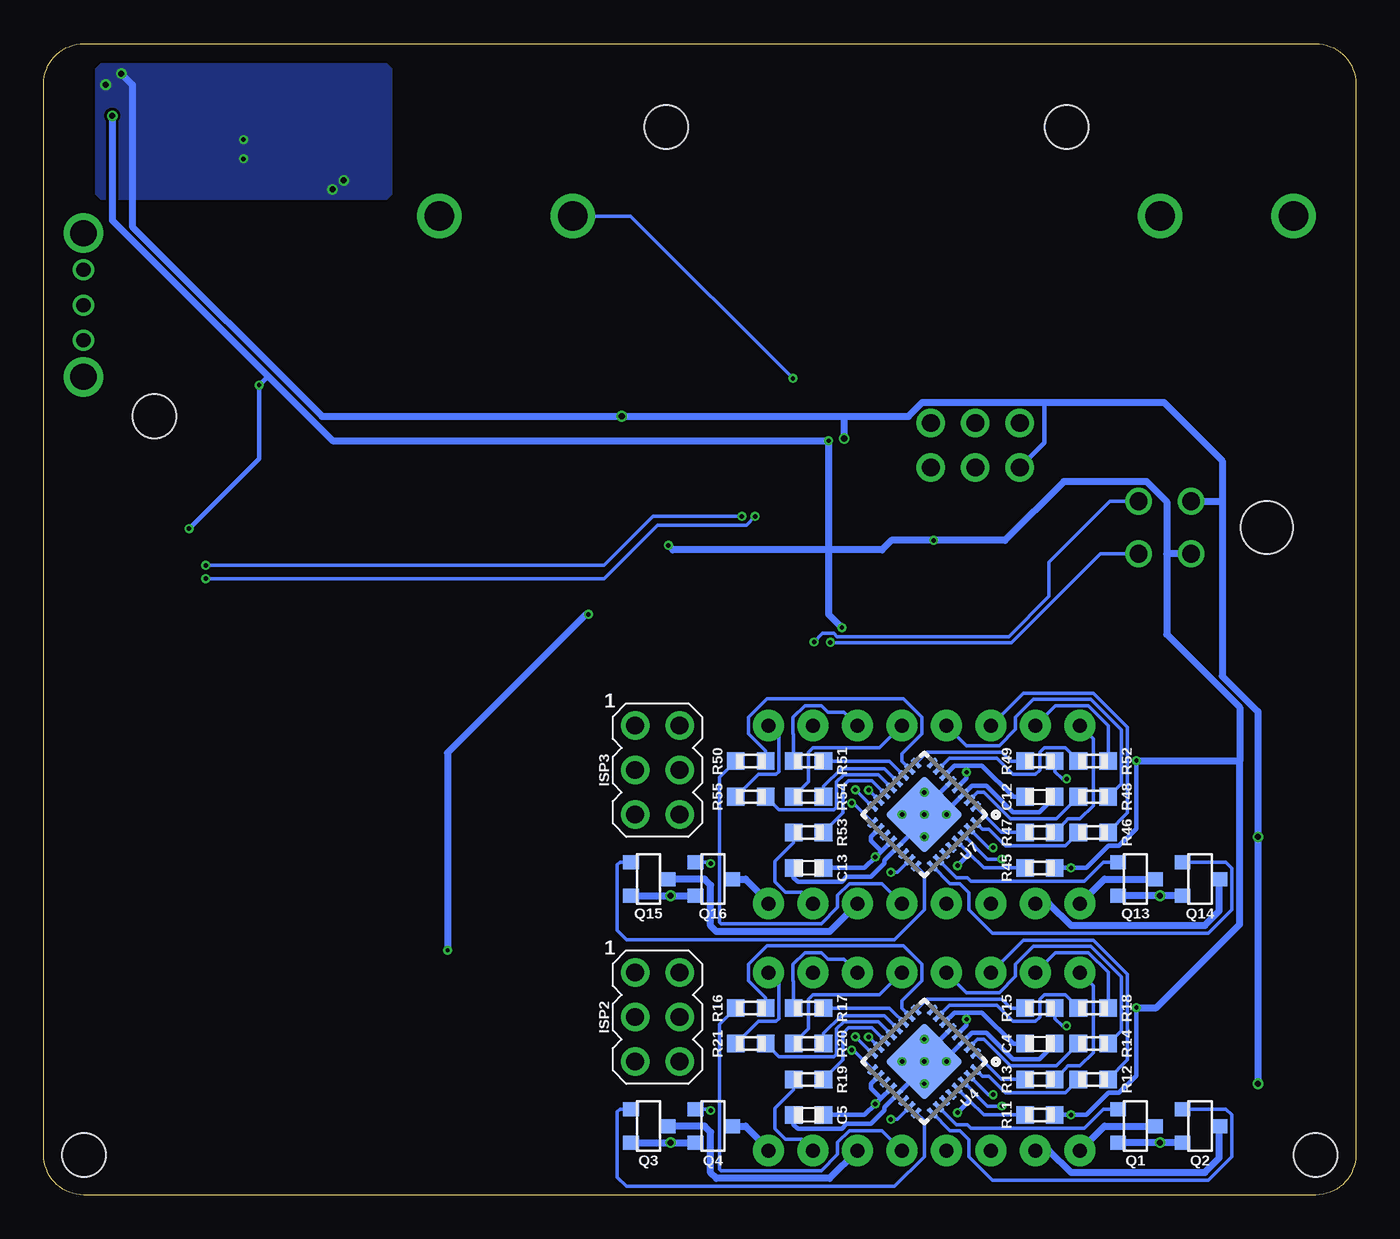
[diagram p3: board, bottom side, seen from below]

Size 74.91 x 65.71 mm. Coordinates in mm from the lower left corner, seen from the top.
Outline: 74.91,2.29 74.91,63.42 arc90 72.62,65.71 2.29,65.71 arc90 0,63.42 0,2.29 arc90 2.29,0 72.62,0 arc90 74.91,2.29
Copper layers (1*16): Top 0.035559375mm / dielectric 1.6mm / Bottom 0.035559375mm
Design rules "oshpark-2layer": minimum track width 6mil, minimum drill 10mil, track to track 6mil, track to pad 6mil, pad to pad 6mil, via to via 6mil, smd to smd 6mil, copper to edge 15mil, drill to drill 6mil, minimum pad ring 5mil, minimum via ring 5mil, stop-mask expansion 2.5mil, vias tented up to drill 0mil, thermal gap 10mil

### Footprints (pad centres in the part's own frame; a part is rotated, then mirrored left to right if it is on the bottom)
BAT_AA_BK-92 = drill 1.7: NEG@1 0,-16.765; NEG@2 0,-24.385; POS@1 0,24.385; POS@2 0,16.765
C0402 = smd 0.7 x 0.9: 1 -0.65,0; 2 0.65,0
C0603 = smd 1 x 1: 1 -0.85,0; 2 0.85,0
C0805 = smd 1.3 x 1.5: 1 -0.95,0; 2 0.95,0
LED_0603 = smd 0.8 x 0.8: ANODE 0.8,0; CATHODE -0.8,0
7-SEGMENT-4DIGIT-YOUNGSUN = drill 0.8 pad 1.778: 1 -8.89,-5.08; 2 -6.35,-5.08; 3 -3.81,-5.08; 4 -1.27,-5.08; 5 1.27,-5.08; 6 3.81,-5.08; 7 6.35,-5.08; 8 8.89,-5.08; 9 8.89,5.08; 10 6.35,5.08; 11 3.81,5.08; 12 1.27,5.08; 13 -1.27,5.08; 14 -3.81,5.08; 15 -6.35,5.08; 16 -8.89,5.08
2_56 = hole 2.5: 0,0
AVRISP = drill 1.02 pad 1.626: 1 -1.27,2.54; 2 1.27,2.54; 3 -1.27,0; 4 1.27,0; 5 -1.27,-2.54; 6 1.27,-2.54
2X2_MICROFIT_RT = drill 1.02: 1 1.5,4.32; 2 -1.5,4.32; 3 1.5,7.32; 4 -1.5,7.32 | hole 3: 0,0
WE-MAPI(3X3) = smd 1.3 x 3.4: P$1 -1.05,0; P$2 1.05,0
SOT23-3 = smd 0.8 x 0.9: 1 -0.95,-1; 2 0.95,-1; 3 0,1.1
R0603 = smd 1 x 1: 1 -0.85,0; 2 0.85,0
219-8_GULLWING_DIP-CTS = smd 1.13 x 2.44: 1 -8.89,4.3; 2 -6.35,4.3; 3 -3.81,4.3; 4 -1.27,4.3; 5 1.27,4.3; 6 3.81,4.3; 7 6.35,4.3; 8 8.89,4.3; 9 8.89,-4.3; 10 6.35,-4.3; 11 3.81,-4.3; 12 1.27,-4.3; 13 -1.27,-4.3; 14 -3.81,-4.3; 15 -6.35,-4.3; 16 -8.89,-4.3
SWITCH_6MM = smd 1.55 x 1.3: 1 -3.975,2.25; 2 3.975,2.25; 3 -3.975,-2.25; 4 3.975,-2.25
OS102011MS2QN1 = drill 0.8: 1 -2,0; 2 0,0; 3 2,0 | drill 1.5: BODY@1 -4.1,0; BODY@2 4.1,0
MLF44-TH = smd 0.7 x 0.3: 1 -3.325,2.5; 2 -3.325,2; 3 -3.325,1.5; 4 -3.325,1; 5 -3.325,0.5; 6 -3.325,0; 7 -3.325,-0.5; 8 -3.325,-1; 9 -3.325,-1.5; 10 -3.325,-2; 11 -3.325,-2.5; 23 3.325,-2.5; 24 3.325,-2; 25 3.325,-1.5; 26 3.325,-1; 27 3.325,-0.5; 28 3.325,0; 29 3.325,0.5; 30 3.325,1; 31 3.325,1.5; 32 3.325,2; 33 3.325,2.5 | smd 0.3 x 0.7: 12 -2.5,-3.325; 13 -2,-3.325; 14 -1.5,-3.325; 15 -1,-3.325; 16 -0.5,-3.325; 17 0,-3.325; 18 0.5,-3.325; 19 1,-3.325; 20 1.5,-3.325; 21 2,-3.325; 22 2.5,-3.325; 34 2.5,3.325; 35 2,3.325; 36 1.5,3.325; 37 1,3.325; 38 0.5,3.325; 39 0,3.325; 40 -0.5,3.325; 41 -1,3.325; 42 -1.5,3.325; 43 -2,3.325; 44 -2.5,3.325 | smd 5 x 5: TH 0,0
TSSOP16 = smd 0.305 x 0.991: 1 -2.275,-2.918; 2 -1.625,-2.918; 3 -0.975,-2.918; 4 -0.325,-2.918; 5 0.325,-2.918; 6 0.975,-2.918; 7 1.625,-2.918; 8 2.275,-2.918; 9 2.275,2.918; 10 1.625,2.918; 11 0.975,2.918; 12 0.325,2.918; 13 -0.325,2.918; 14 -0.975,2.918; 15 -1.625,2.918; 16 -2.275,2.918
MLF32-5X5 = smd 0.7 x 0.3: 1 -2.4,1.75; 2 -2.4,1.25; 3 -2.4,0.75; 4 -2.4,0.25; 5 -2.4,-0.25; 6 -2.4,-0.75; 7 -2.4,-1.25; 8 -2.4,-1.75; 17 2.4,-1.75; 18 2.4,-1.25; 19 2.4,-0.75; 20 2.4,-0.25; 21 2.4,0.25; 22 2.4,0.75; 23 2.4,1.25; 24 2.4,1.75 | smd 0.3 x 0.7: 9 -1.75,-2.4; 10 -1.25,-2.4; 11 -0.75,-2.4; 12 -0.25,-2.4; 13 0.25,-2.4; 14 0.75,-2.4; 15 1.25,-2.4; 16 1.75,-2.4; 25 1.75,2.4; 26 1.25,2.4; 27 0.75,2.4; 28 0.25,2.4; 29 -0.25,2.4; 30 -0.75,2.4; 31 -1.25,2.4; 32 -1.75,2.4 | smd 3.1 x 3.1: TH 0,0
DSG0008A = smd 0.5 x 0.25: 1 -0.95,0.75; 2 -0.95,0.25; 3 -0.95,-0.25; 4 -0.95,-0.75; 5 0.95,-0.75; 6 0.95,-0.25; 7 0.95,0.25; 8 0.95,0.75 | smd 0.9 x 1.6: EP@1 0,0 | drill 0.254 pad 0.305: EP@2 0,0.55; EP@3 0,-0.55
CRYSTAL_5X3.2_2-SMD = smd 1.7 x 2.4: OSC1 -1.85,0; OSC2 1.85,0

### Placement (x,y rotation side)
BT1  27.94,55.88 270 top
C1  19.18,37.59 90 top
C2  19.18,34.54 270 top
C3  72.39,36.83 270 top
C4  18.03,8.64 0 bottom
C5  31.24,4.57 180 bottom
C6  56.39,58.8 270 top
C7  70.99,59.05 270 top
C8  66.93,62.61 90 top
C9  68.96,62.61 90 top
C10  29.21,41.91 180 top
C11  35.31,36.83 180 top
C12  18.03,22.73 0 bottom
C13  31.24,18.67 180 bottom
D1  51.05,9.02 180 top
D2  51.05,6.86 180 top
D3  51.05,4.7 180 top
D4  51.05,2.54 180 top
D5  51.05,22.99 180 top
D6  51.05,20.83 180 top
D7  51.05,18.67 180 top
D8  51.05,16.51 180 top
D9  64.77,50.42 270 top
D10  68.58,50.42 90 top
D11  60.96,50.42 90 top
D12  38.61,43.18 180 top
D13  38.61,45.34 180 top
DS1  24.64,7.62 0 top
DS2  24.64,21.72 0 top
H1  2.29,2.29 0 top
H2  72.62,2.29 0 top
H3  16.51,60.96 0 top
H4  39.37,60.96 0 top
H5  68.58,44.45 0 top
ISP1  21.72,42.8 270 top
ISP2  39.88,10.16 0 bottom
ISP3  39.88,24.26 0 bottom
J1  5.08,38.1 270 top
L1  59.44,61.09 0 top
Q1  12.57,3.94 270 bottom
Q2  8.89,3.94 270 bottom
Q3  40.39,3.94 270 bottom
Q4  36.7,3.94 270 bottom
Q5  57.15,54.61 180 top
Q13  12.57,18.03 270 bottom
Q14  8.89,18.03 270 bottom
Q15  40.39,18.03 270 bottom
Q16  36.7,18.03 270 bottom
R1  37.85,34.92 90 top
R2  39.88,34.92 90 top
R3  63.5,44.45 90 top
R4  60.96,44.45 90 top
R5  58.42,44.45 90 top
R6  55.88,44.45 90 top
R7  53.34,44.45 90 top
R8  50.8,44.45 90 top
R9  48.26,44.45 90 top
R10  45.72,44.45 90 top
R11  18.03,4.57 0 bottom
R12  14.99,6.6 180 bottom
R13  18.03,6.6 180 bottom
R14  14.99,8.64 180 bottom
R15  18.03,10.67 180 bottom
R16  34.54,10.67 0 bottom
R17  31.24,10.67 0 bottom
R18  14.99,10.67 180 bottom
R19  31.24,6.6 0 bottom
R20  31.24,8.64 0 bottom
R21  34.54,8.64 0 bottom
R22  63.5,63.5 180 top
R23  68.96,59.05 90 top
R24  66.93,59.05 90 top
R25  37.85,37.97 270 top
R26  48.13,9.02 180 top
R27  48.13,6.86 180 top
R28  48.13,4.7 180 top
R29  48.13,2.54 180 top
R30  48.13,22.99 180 top
R31  48.13,20.83 180 top
R32  48.13,18.67 180 top
R33  48.13,16.51 180 top
R34  64.77,53.34 90 top
R35  68.58,53.34 90 top
R36  60.96,53.34 90 top
R37  26.67,42.42 270 top
R38  35.56,43.18 180 top
R39  35.56,45.34 180 top
R40  31.75,44.45 90 top
R45  18.03,18.67 0 bottom
R46  14.99,20.7 180 bottom
R47  18.03,20.7 180 bottom
R48  14.99,22.73 180 bottom
R49  18.03,24.77 180 bottom
R50  34.54,24.77 0 bottom
R51  31.24,24.77 0 bottom
R52  14.99,24.77 180 bottom
R53  31.24,20.7 0 bottom
R54  31.24,22.73 0 bottom
R55  34.54,22.73 0 bottom
S1  54.61,36.83 180 top
S2  68.58,7.62 180 top
S3  68.58,16.51 180 top
S4  68.58,25.4 0 top
S5  72.64,50.8 270 top
U1  29.21,36.83 0 top
U2  68.58,36.83 0 top
U4  24.64,7.62 225 bottom
U5  63.5,59.69 180 top
U7  24.64,21.72 225 bottom
XTAL1  21.59,36.07 90 top

### Tracks (layer width: path | path; a pad name or v marks a point on that pad's centre or on a via)
3V3  (via drill 0.25, 0.35)
  Top 0.2: R37.2 26.63,41.53 ISP1.2
  Top 0.254: ISP2.2 36.45,10.54 28.07,10.54 26.1,8.57 | ISP3.2 36.45,24.64 28.07,24.64 26.1,22.67 | R10.2 R9.2 R8.2 R7.2 R6.2 R5.2 R4.2 62.23,45.3 | 62.23,45.3 R3.2 | C3.1 66.97,37.68 v66.61,38.04 66.31,38.34 U2.16 | U1.27 33.52,36.33 33.91,35.94 35.94,35.94 36.16,36.16 C11.1 36.16,37.5 35.92,37.74 33.8,37.74 33.39,37.33 U1.29 | R37.2 26.67,42.16 26.92,42.42 27.3,42.42 28.7,43.81 29.72,43.81 30.1,43.43 v30.1,43.05 | C7.1 72.68,59.91 72.9,59.69 72.9,57.66 70.74,55.5 68.83,55.5 68.58,55.24 R35.2 | 62.23,45.3 62.23,45.85 v62.61,46.23
  Top 0.305: U1.17 29.21,32.51 v29.34,32.38 | v24.1,37.36 24.13,37.33 U1.5 | U1.38 29.71,40.89 30.06,41.24 C10.1 30.06,42 30.1,42.04 v30.1,43.05 | R25.2 39.2,37.12 v39.24,37.08 39.88,36.45 R2.2 | R25.2 37.55,36.83 C11.1 | R1.2 R25.2
  Top 0.406: v27.43,5.21 27.43,7.24 26.1,8.57 24.64,10.03 v22.23,10.03 19.81,10.03 19.15,10.69 v12.53,10.69 | v27.43,19.3 27.43,21.34 26.1,22.67 24.64,24.13 v22.23,24.13 19.81,24.13 19.15,24.79 v12.53,24.79
  Bottom 0.254: U4.6 22.91,10.41 22.23,10.41 | C4.1 19.56,8.64 21.34,10.41 22.23,10.41 | U4.4 22.23,9.68 v22.23,10.03 22.23,10.41 | C5.1 28.04,4.57 27.43,5.18 v27.43,5.21 27.41,5.21 27.1,5.51 | U4.18 27.69,6.34 27.69,6.1 27.1,5.51 | R11.2 v16.26,4.57 15.37,4.57 14.11,5.83 13.52,5.83 12.53,6.82 v12.53,10.69 | U7.6 22.91,24.51 22.23,24.51 | C12.1 19.56,22.73 21.34,24.51 22.23,24.51 | U7.4 22.23,23.78 v22.23,24.13 22.23,24.51 | C13.1 28.04,18.67 27.41,19.3 | U7.18 27.69,20.44 27.69,20.22 27.09,19.62 | R45.2 v16.26,18.67 15.37,18.67 14.11,19.92 13.52,19.92 12.53,20.92 v12.53,24.79 | 62.17,46.8 62.17,46.67 v62.61,46.23 62.61,42.04 v66.61,38.04 | 27.1,5.51 U4.20 | U7.20 27.09,19.62 | 27.09,19.62 27.41,19.3 | 27.41,19.3 v27.43,19.3
  Bottom 0.406: v12.53,10.69 11.38,10.69 6.63,15.44 6.63,24.77 | 6.63,24.77 6.63,27.84 10.79,32 10.79,36.58 | 6.63,24.77 6.66,24.79 v12.53,24.79 | v70.99,61.59 70.99,55.63 62.17,46.8 58.42,43.05 v30.1,43.05 30.1,36.83 | 30.1,36.83 30.1,33.15 v29.34,32.38 | 30.1,36.83 27.05,36.83 26.52,37.36 v24.1,37.36 20.03,37.36 16.67,40.72 11.94,40.72 10.79,39.58 10.79,36.58 | 30.1,36.83 38.99,36.83 v39.24,37.08 | J1.1 10.77,36.6 10.79,36.58
  pour Top (no thermals): 68.33,59.18 71.63,59.18 71.88,59.43 71.88,62.23 71.63,62.48 65.02,62.48 64.14,61.59 64.14,59.94 64.26,59.82 64.77,59.82 65.53,60.58 67.82,60.58 68.07,60.33 68.07,59.44
!RESET
  Top 0.2: U1.4 24.81,37.83 22.88,39.76 19.44,39.76 18.11,41.09 18.11,41.99 19.18,43.05 ISP1.5 19.18,45.09 19.43,45.34 25.65,45.34 26.67,44.32 R37.1
!RESET_A  (via drill 0.25)
  Top 0.2: ISP2.5 40.08,6.55 29.5,6.55 27.61,4.67 27.21,4.67 26.92,4.95 25.65,4.95 25.4,4.7 v22.73,4.7
  Bottom 0.2: R11.1 21.24,4.57 22.05,5.38 U4.29
  Bottom 0.254: v22.73,4.7 22.05,5.38
!RESET_B  (via drill 0.25)
  Top 0.2: ISP3.5 40.08,20.65 29.5,20.65 27.61,18.77 27.21,18.77 26.92,19.05 25.65,19.05 25.4,18.8 v22.73,18.8
  Bottom 0.2: R45.1 21.24,18.67 22.05,19.48 U7.29
  Bottom 0.254: v22.73,18.8 22.05,19.48
B0
  Top 0.2: U2.11 69.56,40.55 68.54,41.57 65.19,41.57 64.75,41.13 S1.16
  Top 0.254: S1.16 R3.1
B1
  Top 0.2: U2.12 68.91,40.3 67.99,41.22 65.77,41.22 65.18,40.62 65.18,39.63 64.86,39.31 61.14,39.31 60.96,39.5 60.96,41.27
  Top 0.254: S1.15 60.96,41.27 R4.1
B2
  Top 0.2: U2.13 68.25,40.46 67.85,40.87 65.92,40.87 65.53,40.48 65.53,39.23 65.26,38.96 59.05,38.96 58.42,39.59 58.42,41.4
  Top 0.254: S1.14 58.42,41.4 R5.1
B3
  Top 0.2: U2.14 67.61,40.47 67.56,40.51 66.07,40.51 65.9,40.35 65.9,39.1 65.41,38.61 56.39,38.61 55.88,39.12 55.88,41.27
  Top 0.254: S1.13 55.88,41.27 R6.1
B4
  Top 0.2: U2.3 67.61,33.19 67.56,33.15 66.07,33.15 65.9,33.31 65.9,33.91 63.11,36.7 55.63,36.7 53.34,38.99 53.34,41.53
  Top 0.254: S1.12 53.34,41.53 R7.1
B5
  Top 0.2: U2.4 68.25,33.34 67.71,32.8 65.92,32.8 65.55,33.17 65.55,33.76 62.96,36.35 53.44,36.35 50.8,38.99 S1.11
  Top 0.254: S1.11 R8.1
B6
  Top 0.2: U2.5 68.91,33.22 68.13,32.44 65.77,32.44 65.19,33.02 65.19,33.62 62.81,36 50.36,36 48.26,38.1 48.26,41.27
  Top 0.254: S1.10 48.26,41.27 R9.1
B7
  Top 0.2: U2.6 69.56,32.98 68.67,32.09 65.63,32.09 64.84,32.87 64.84,33.47 62.67,35.65 48.68,35.65 45.72,38.61 S1.9
  Top 0.254: S1.9 R10.1
BAT  (via drill 0.25)
  Top 0.2: R40.2 31.75,46.23 v32.13,46.61
  Top 0.254: BT1.POS@1 53.59,54.61 57.78,54.61 58.1,54.92 Q5.1 | Q5.1 58.37,55.88 | S5.1 70.14,52.8 69.6,53.34 67.94,53.34 65.67,55.61 64.77,55.61 | 64.77,55.61 Q5.1 | R34.2 64.77,55.61
  Top 0.813: BT1.POS@2 BT1.POS@1 52.33,58.42 53.66,59.75 C6.1
  Bottom 0.2: v32.13,46.61 41.4,55.88 BT1.POS@2
  pour Top (rank 2, no thermals): 62.87,58.8 62.87,59.05 62.74,59.18 59.56,59.18 59.18,59.56 59.18,62.62 58.93,62.87 55.37,62.87 55.12,62.62 55.12,59.05 55.37,58.8
BAT_SENSE
  Top 0.2: U1.37 30.21,40.62 31.75,42.16 R40.1
BOOST_EN
  Top 0.254: U5.5 62.55,63.4 R22.2 62.65,64.61 63.25,65.2 72.47,65.2 74.05,63.62 74.05,52.2 S5.2
DIP_CLK  (via drill 0.25)
  Top 0.2: U2.2 66.95,34.65 v65.66,35.94 | U1.32 33.03,38.83 33.45,39.24 34.55,39.24 v35.05,38.73
  Bottom 0.2: v65.66,35.94 42.93,35.94 40.13,38.73 v35.05,38.73
DIP_LD  (via drill 0.25)
  Top 0.2: U2.1 66.31,34.53 v65.66,35.18 | v34.29,38.73 33.53,38.73 33.12,38.33 U1.31
  Bottom 0.2: v65.66,35.18 42.93,35.18 39.88,38.23 34.8,38.23 v34.29,38.73
DIP_OUT
  Top 0.2: U1.33 33.03,39.33 33.3,39.59 36.93,39.59 38.61,41.27 38.61,45.7 38.9,45.99 43.16,45.99 44.7,44.45 64.9,44.45 67.42,41.92 69.84,41.92 70.86,40.91 U2.9
DIS_A1
  Bottom 0.2: DS1.14 18.98,14.55 14.98,14.55 13.03,12.59 13.03,7.71 R12.1
DIS_A2
  Bottom 0.2: DS2.14 18.98,28.64 14.98,28.64 13.03,26.69 13.03,21.81 R46.1
DIS_B1
  Bottom 0.2: DS1.16 14.99,11.94 14.99,8.13 15.75,7.37 16.43,7.37 16.59,7.21 16.59,7.2 R13.1
DIS_B2
  Bottom 0.2: DS2.16 14.99,26.04 14.99,22.23 15.75,21.46 16.43,21.46 16.59,21.31 16.59,21.3 R47.1
DIS_C1
  Bottom 0.2: R14.1 13.38,9.39 13.38,12.45 15.13,14.19 18.41,14.19 19.43,13.17 19.43,12.48 20.36,11.56 22.23,11.56 DS1.13
DIS_C2
  Bottom 0.2: R48.1 13.38,23.48 13.38,26.55 15.13,28.29 18.41,28.29 19.43,27.27 19.43,26.58 20.36,25.66 22.23,25.66 DS2.13
DIS_COL1
  Bottom 0.2: R20.1 31.24,9.49 31.24,11.18 31,11.42 27.19,11.42 DS1.12
DIS_COL2
  Bottom 0.2: R54.1 31.24,23.58 31.24,25.27 31,25.52 27.19,25.52 DS2.12
DIS_D1  (via drill 0.25)
  Top 0.2: DS1.3 20.83,3.68 21.21,4.06 21.21,7.49 19.05,9.65 v16.51,9.65
  Bottom 0.2: v16.51,9.65 16.76,9.65 17.18,10.07 R15.1
DIS_D2  (via drill 0.25)
  Top 0.2: DS2.3 20.83,17.78 21.21,18.16 21.21,21.59 19.05,23.75 v16.51,23.75
  Bottom 0.2: v16.51,23.75 16.76,23.75 17.18,24.17 R49.1
DIS_DIG1_1
  Bottom 0.406: DS1.1 14.35,3.94 Q1.3
DIS_DIG1_2
  Bottom 0.406: DS2.1 14.35,18.03 Q13.3
DIS_DIG2_1
  Bottom 0.406: DS1.2 17.51,2.54 16.26,1.29 8.61,1.29 7.79,2.12 Q2.3
DIS_DIG2_2
  Bottom 0.406: DS2.2 17.51,16.64 16.26,15.39 8.61,15.39 7.79,16.21 Q14.3
DIS_DIG3_1
  Bottom 0.406: DS1.6 30.05,0.94 36.5,0.94 36.83,1.27 36.83,3.59 37.17,3.94 Q3.3
DIS_DIG3_2
  Bottom 0.406: DS2.6 30.05,15.04 36.5,15.04 36.83,15.37 36.83,17.69 37.17,18.03 Q15.3
DIS_DIG4_1
  Bottom 0.406: Q4.3 34.84,3.94 33.53,2.62 DS1.8
DIS_DIG4_2
  Bottom 0.406: Q16.3 34.84,18.03 33.53,16.72 DS2.8
DIS_DP1
  Bottom 0.2: DS1.7 31.62,3.17 32.55,3.17 33.15,3.77 33.15,4.95 32.09,6.01 R19.1
DIS_DP2
  Bottom 0.2: DS2.7 31.62,17.27 32.55,17.27 33.15,17.87 33.15,19.05 32.09,20.11 R53.1
DIS_E1
  Bottom 0.2: R16.1 36.32,9.74 36.32,1.47 36.25,1.4 30.52,1.4 29.59,2.32 29.59,3.01 28.92,3.68 27.05,3.68 DS1.5
DIS_E2
  Bottom 0.2: R50.1 36.32,23.84 36.32,15.57 36.25,15.5 30.52,15.5 29.59,16.42 29.59,17.11 28.92,17.78 27.05,17.78 DS2.5
DIS_F1
  Bottom 0.2: DS1.11 29.21,13.46 30.14,13.46 30.52,13.84 31.46,13.84 32.13,13.17 32.13,12.23 32.09,12.19 R17.1
DIS_F2
  Bottom 0.2: DS2.11 29.21,27.56 30.14,27.56 30.52,27.94 31.46,27.94 32.13,27.27 32.13,26.32 32.09,26.29 R51.1
DIS_G1
  Bottom 0.2: R18.1 14.14,12.7 15.28,13.84 17.15,13.84 DS1.15
DIS_G2
  Bottom 0.2: R52.1 14.14,26.8 15.28,27.94 17.15,27.94 DS2.15
DIS_POS1
  Bottom 0.2: R21.1 34.11,9.92 33.09,9.92 32.94,10.06 32.94,12.11 DS1.9
DIS_POS2
  Bottom 0.2: R55.1 34.11,24.01 33.09,24.01 32.94,24.16 32.94,26.21 DS2.9
DISP_SEL_A
  Top 0.2: R1.1 34.53,34.08 33.28,35.33 U1.25
  Top 0.254: S2.1 64.9,5.37 S2.2 59.34,5.37 55.24,1.27 48.77,1.27 48.06,1.98 48.06,26.89 41.99,32.97 38.95,32.97 R1.1
DISP_SEL_B
  Top 0.2: U1.26 33.28,35.83 34.18,34.92 39.03,34.92 R2.1
  Top 0.254: S3.1 S3.2 61.25,14.26 53.72,6.73 53.72,2.03 53.37,1.68 51.52,1.68 51.05,2.15 51.05,3.37 51.05,3.56 51.05,24.51 42.12,33.44 40.51,33.44 R2.1
DISP_STAT_D1_A
  Top 0.254: R28.2 45.72,4.7 44.35,6.07 44.35,26.58 40.81,30.12 29.5,30.12 27.71,31.92 U1.14
DISP_STAT_D1_B
  Top 0.254: U1.22 31.71,32.75 32.71,31.75 41.48,31.75 45.97,27.26 45.97,20.32 47.28,19.01 R32.2
DISP_STAT_D2_A
  Top 0.254: R29.2 45.72,2.54 43.94,4.32 43.94,26.42 40.64,29.72 29.34,29.72 27.21,31.84 U1.13
DISP_STAT_D2_B
  Top 0.254: R33.2 46.08,16.51 45.57,17.02 45.57,27.09 41.31,31.34 32.54,31.34 31.21,32.67 U1.21
DISP_STAT_I_A
  Top 0.254: R27.2 45.72,6.86 44.76,7.82 44.76,26.75 40.98,30.53 29.67,30.53 28.21,31.99 U1.15
DISP_STAT_I_B
  Top 0.254: R31.2 47.28,21.58 46.38,22.48 46.38,27.43 41.65,32.16 35.22,32.16 33.04,34.33 U1.23
DISP_STAT_V_A
  Top 0.254: R26.2 45.72,9.02 45.16,9.58 45.16,26.92 41.15,30.94 29.84,30.94 28.71,32.07 U1.16
DISP_STAT_V_B
  Top 0.254: R30.2 47.28,27.1 41.82,32.56 35.51,32.56 33.24,34.83 U1.24
FB
  Top 0.254: U5.2 65.28,59.44 65.75,59.91 R24.2 67.6,59.91 67.94,59.56 67.94,58.55 68.29,58.2 R23.1 C7.2
GND  (via drill 0.25, 0.35)
  Top 0.254: U2.10 70.2,38.89 70.48,38.61 73.82,38.61 | C2.1 C1.1 18.3,36.94 18.03,37.21 18.03,38.73 18.54,39.24 22.86,39.24 23.5,38.61 23.5,37.21 23.88,36.83 U1.6 | U1.28 C11.2 34.58,36.83 | S2.4 S2.3 73.75,9.87 74.38,10.5 74.38,20.24 73.66,20.95 72.52,20.95 | D11.CATHODE 62.01,49.62 62.83,48.8 68.58,48.8 | D12.CATHODE 39.41,44.45 | 39.41,44.45 D13.CATHODE | 39.41,44.45 v41.91,44.45 | 72.52,20.95 64.64,20.95 | 64.64,20.95 62.99,20.95 56.01,13.97 v51.85,13.97 | S3.4 64.64,18.8 64.64,20.95 | S4.3 64.64,23.11 64.64,20.95 | 73.82,35.94 73.78,35.98 C3.2 71.5,35.98 70.86,35.33 U2.8 | S5.3 68.58,48.8 | D10.CATHODE 68.58,48.8 | S4.4 72.56,20.99 | 72.56,20.99 72.52,20.95 | S3.3 72.56,20.99
  Top 0.305: U1.18 29.71,36.33 U1.TH | U1.28 U1.TH | U1.6 U1.TH | U1.TH U1.39 29.21,41.91 | C10.2 29.21,41.91 | v29.21,43.18 29.21,41.91 | D4.CATHODE D3.CATHODE D2.CATHODE D1.CATHODE v51.85,13.97 D8.CATHODE D7.CATHODE D6.CATHODE D5.CATHODE | v43.81,33.15 44.43,32.53 S1.8 S1.7 S1.6 S1.5 S1.4 S1.3 S1.2 S1.1 64.61,32.53 65.46,31.68 72.33,31.68 73.82,33.18 73.82,35.94 73.82,38.61 73.82,44.58 74.07,44.84 74.07,48.13 73.41,48.8 S5.3
  Top 0.406: v11.18,2.99 11.18,5.91 10.73,6.35 v5.59,6.35 | v11.18,17.08 11.18,20 10.73,20.45 v5.59,20.45 | v41.91,44.45 41.91,35.05 v43.81,33.15
  Top 0.813: Q5.2 56.2,57.72 56.26,57.72 C6.2
  Bottom 0.254: C4.2 18.07,7.75 19.57,7.75 21.08,9.27 21.93,9.27 U4.3 23.58,7.62 U4.TH | U4.TH 24.64,7.27 U4.21 26.9,5.01 26.9,4.85 27.69,4.06 29.08,4.06 29.35,3.79 31.86,3.79 32.09,4.03 C5.2 | U4.5 24.64,7.97 U4.TH | C12.2 18.07,21.85 19.57,21.85 21.08,23.37 21.93,23.37 U7.3 23.58,21.72 U7.TH | U7.TH 24.64,21.36 U7.21 26.9,19.1 26.9,18.95 27.69,18.16 29.08,18.16 29.35,17.89 31.86,17.89 32.09,18.12 C13.2 | U7.5 24.64,22.07 U7.TH | ISP1.6 17.78,42.93 17.78,45.24
  Bottom 0.406: Q4.2 v39.12,2.99 Q3.2 | Q1.2 v11.18,2.99 Q2.2 | Q16.2 v39.12,17.08 Q15.2 | Q13.2 v11.18,17.08 Q14.2 | v70.48,64.01 69.85,63.37 69.85,55.27 59.03,44.45 v41.91,44.45 29.21,44.45 | 7.62,39.62 7.62,41.91 10.95,45.24 17.78,45.24 24.74,45.24 25.53,44.45 29.21,44.45 | 7.62,39.62 7.62,29.62 5.59,27.59 v5.59,20.45 v5.59,6.35 | J1.2 7.64,39.6 7.62,39.62 | 29.21,44.45 v29.21,43.18 | v43.81,33.15 43.94,33.15 51.85,25.23 v51.85,13.97
  other vias: 24.64,7.62 23.37,7.62 24.64,6.35 25.91,7.62 24.64,8.89 58.42,57.4 57.78,57.91 71.37,63.37 24.64,21.72 23.37,21.72 24.64,20.45 25.91,21.72 24.64,22.99
  pour Top (rank 3, no thermals): 63.76,56.9 55.37,56.9 55.12,57.15 55.12,58.17 55.37,58.42 62.48,58.42 63.12,59.05 63.12,61.85 63.5,62.23 63.5,64.27 63.75,64.52 71.63,64.52 71.88,64.27 71.88,63.12 71.63,62.87 64.9,62.87 64.01,61.98 64.01,59.31 64.26,59.05 65.66,59.05 65.91,58.8 67.31,58.8 67.44,58.67 67.44,57.78 67.31,57.66 66.29,57.66 65.15,58.8 64.26,58.8 64.01,58.55 64.01,57.15
  pour Bottom (rank 3, no thermals): 55.12,64.27 55.12,57.15 55.37,56.9 71.63,56.9 71.88,57.15 71.88,64.27 71.63,64.52 55.37,64.52
  pour Top: 41.92,13.97 7.36,13.97 6.86,13.47 6.86,1.77 7.36,1.27 41.92,1.27 42.42,1.77 42.42,13.47
  pour Top: 41.92,28.07 7.36,28.07 6.86,27.57 6.86,15.87 7.36,15.37 41.92,15.37 42.42,15.87 42.42,27.57
HOLD
  Top 0.2: U1.30 33.36,37.83 33.64,38.12 37.85,38.12 | S4.1 48.45,27.65 40.63,35.47 40.63,37.35 39.86,38.12 37.85,38.12 | R25.1 37.85,38.12
  Top 0.254: S4.1 S4.2
MCU_A1
  Bottom 0.2: R12.2 16.58,5.85 20.01,5.85 20.94,6.78 21.32,6.78 U4.32
MCU_A2
  Bottom 0.2: R46.2 16.58,19.95 20.01,19.95 20.94,20.88 21.32,20.88 U7.32
MCU_B1
  Bottom 0.2: R13.2 20.23,6.6 U4.1
MCU_B2
  Bottom 0.2: R47.2 20.23,20.7 U7.1
MCU_C1
  Bottom 0.2: R14.2 16.43,8.04 16.43,8.03 17.09,7.38 19.72,7.38 21.24,8.89 21.6,8.89 U4.2
MCU_C2
  Bottom 0.2: R48.2 16.43,22.14 16.43,22.13 17.09,21.47 19.72,21.47 21.24,22.99 21.6,22.99 U7.2
MCU_COL1
  Bottom 0.2: U4.12 26.91,10.25 29.38,10.25 30.39,9.23 R20.2
MCU_COL2
  Bottom 0.2: U7.12 26.91,24.34 29.38,24.34 30.39,23.33 R54.2
MCU_D1
  Bottom 0.2: R15.2 19.68,10.67 20.19,11.18 24.48,11.18 U4.9
MCU_D2
  Bottom 0.2: R49.2 19.68,24.77 20.19,25.27 24.48,25.27 U7.9
MCU_DIG1_1
  Bottom 0.2: U4.26 22.81,4.02 22.17,4.02 21.97,3.82 15.48,3.82 14.42,4.89 Q1.1
MCU_DIG1_2
  Bottom 0.2: U7.26 22.81,18.12 22.17,18.12 21.97,17.92 15.48,17.92 14.42,18.98 Q13.1
MCU_DIG2_1
  Bottom 0.2: U4.25 23.16,3.67 22.61,3.67 22.1,3.16 22.1,2.2 20.74,0.84 8.42,0.84 7.09,2.17 7.09,4.57 7.41,4.89 Q2.1
MCU_DIG2_2
  Bottom 0.2: U7.25 23.16,17.77 22.61,17.77 22.1,17.26 22.1,16.29 20.74,14.94 8.42,14.94 7.09,16.27 7.09,18.67 7.41,18.98 Q14.1
MCU_DIG3_1
  Bottom 0.2: U4.24 24.64,4.23 24.64,2.2 26.35,0.49 41.63,0.49 42.16,1.02 42.16,4.74 42.02,4.89 Q3.1
MCU_DIG3_2
  Bottom 0.2: U7.24 24.64,18.32 24.64,16.29 26.35,14.58 41.63,14.58 42.16,15.11 42.16,18.84 42.02,18.98 Q15.1
MCU_DIG4_1  (via drill 0.25)
  Top 0.2: v26.54,4.32 36.32,4.32 v36.83,4.83
  Bottom 0.2: U4.23 26.17,4.32 v26.54,4.32 | v36.83,4.83 36.89,4.89 Q4.1
MCU_DIG4_2  (via drill 0.25)
  Top 0.2: v26.54,18.41 36.32,18.41 v36.83,18.92
  Bottom 0.2: U7.23 26.17,18.41 v26.54,18.41 | v36.83,18.92 36.89,18.98 Q16.1
MCU_DP1
  Bottom 0.2: U4.14 27.62,9.54 28.96,9.54 29.29,9.21 29.29,7.71 R19.2
MCU_DP2
  Bottom 0.2: U7.14 27.62,23.64 28.96,23.64 29.29,23.31 29.29,21.81 R53.2
MCU_E1
  Bottom 0.2: U4.10 25.91,10.66 25.91,11.09 24.77,12.23 24.77,13.17 25.82,14.22 33.62,14.22 34.67,13.17 34.67,12.23 33.69,11.25 R16.2
MCU_E2
  Bottom 0.2: U7.10 25.91,24.75 25.91,25.18 24.77,26.32 24.77,27.27 25.82,28.32 33.62,28.32 34.67,27.27 34.67,26.32 33.69,25.35 R50.2
MCU_F1
  Bottom 0.2: U4.11 26.43,10.47 26.62,10.67 R17.2
MCU_F2
  Bottom 0.2: U7.11 26.43,24.57 26.62,24.77 R51.2
MCU_G1
  Bottom 0.2: U4.7 23.2,10.82 20.48,10.82 19.57,9.92 18.28,9.92 18.03,10.16 18.03,11.18 17.79,11.42 16.58,11.42 R18.2
MCU_G2
  Bottom 0.2: U7.7 23.2,24.92 20.48,24.92 19.57,24.01 18.28,24.01 18.03,24.26 18.03,25.27 17.79,25.52 16.58,25.52 R52.2 15.84,24.76
MCU_POS1
  Bottom 0.2: U4.13 27.27,9.89 29.23,9.89 29.64,9.49 29.64,8.03 29.79,7.88 32.94,7.88 R21.2
MCU_POS2
  Bottom 0.2: U7.13 27.27,23.99 29.23,23.99 29.64,23.58 29.64,22.13 29.79,21.98 32.94,21.98 R55.2
MISO
  Top 0.2: U1.2 24.81,38.83 23.17,40.46 21.28,40.46 20.65,41.09 20.65,41.97 21.28,42.59 22.51,42.59 23.98,44.07 ISP1.1
MISO_A  (via drill 0.25)
  Top 0.2: ISP2.1 39.67,11.22 39.67,9.72 39.05,9.1 28.64,9.1 v28.57,9.04
  Bottom 0.2: v28.57,9.04 27.62,8.08 U4.16
MISO_B  (via drill 0.25)
  Top 0.2: ISP3.1 39.67,25.32 39.67,23.82 39.05,23.19 28.64,23.19 v28.57,23.13
  Bottom 0.2: v28.57,23.13 27.62,22.18 U7.16
MOSI
  Top 0.2: U1.1 24.8,39.33 22.61,41.53 ISP1.4
MOSI_A  (via drill 0.25)
  Top 0.2: v27.81,9.02 28.95,10.16 ISP2.4
  Bottom 0.2: U4.15 v27.8,9.02 v27.81,9.02
MOSI_B  (via drill 0.25)
  Top 0.2: v27.81,23.11 28.95,24.26 ISP3.4
  Bottom 0.2: U7.15 v27.8,23.11 v27.81,23.11
N$1
  Top 0.254: R26.1 D1.ANODE
N$2
  Top 0.254: R27.1 D2.ANODE
N$3
  Top 0.254: R28.1 D3.ANODE
N$4
  Top 0.254: R29.1 D4.ANODE
N$5
  Top 0.254: R30.1 D5.ANODE
N$6
  Top 0.254: R31.1 D6.ANODE
N$7
  Top 0.254: R32.1 D7.ANODE
N$8
  Top 0.254: R33.1 D8.ANODE
N$9
  Top 0.254: D10.ANODE R35.1
N$10
  Top 0.254: Q5.3 58.42,53.51 59.88,54.97 62,54.97 62.61,54.36 62.61,50.29 63.28,49.62 D9.ANODE
  Top 0.813: Q5.3 13.54,53.51 BT1.NEG@1 BT1.NEG@2
N$11
  Top 0.254: R34.1 D9.CATHODE
N$12
  Top 0.254: R38.1 D12.ANODE
N$13
  Top 0.2: XTAL1.OSC1 21.59,35.36 22.06,35.83 U1.8
  Top 0.254: C2.2 21.27,33.89 XTAL1.OSC1
N$14
  Top 0.254: R36.1 D11.ANODE
N$15
  Top 0.2: XTAL1.OSC2 21.59,36.77 22.04,36.33 U1.7
  Top 0.254: C1.2 21.27,38.24 XTAL1.OSC2
N$16
  Top 0.254: R39.1 D13.ANODE
PG
  Top 0.254: U1.36 30.71,40.58 31.32,41.19 32.49,41.19 33.25,41.95 33.25,45.27 35.6,47.62 55.75,47.62 58.8,50.67 58.8,53.05 59.94,54.19 R36.2
RX1  (via drill 0.25)
  Top 0.2: v20.19,5.08 18.11,7.16 6.17,7.16 5.03,8.29 5.03,26.62 8.89,30.48 11.32,30.48 12.41,31.57 24.36,31.57 25.02,32.22 25.02,34.42 25.43,34.83 U1.10
  Bottom 0.2: 22.41,6.43 U4.30 21.04,5.08 v20.19,5.08
RX2  (via drill 0.25)
  Top 0.2: v20.19,19.18 18.79,19.18 13.68,24.28 12.31,24.28 12.02,24.58 12.02,28.53 14.35,30.86 25.02,30.86 26.71,32.55 U1.12
  Bottom 0.2: 22.41,20.53 U7.30 21.04,19.18 v20.19,19.18
SCK
  Top 0.2: U1.3 24.81,38.33 23.03,40.11 21.13,40.11 20.3,40.94 20.3,42.65 ISP1.3
SCK_A  (via drill 0.25)
  Top 0.2: v28.78,8.27 29.25,8.74 39.73,8.74 ISP2.3
  Bottom 0.2: U4.17 28.68,8.27 v28.78,8.27
SCK_B  (via drill 0.25)
  Top 0.2: v28.78,22.37 29.25,22.84 39.73,22.84 ISP3.3
  Bottom 0.2: U7.17 28.68,22.37 v28.78,22.37
SCL  (via drill 0.25)
  Top 0.254: U1.19 30.21,31.76 v30,31.55
  Bottom 0.2: v30,31.55 29.78,31.55 29.76,31.53 19.66,31.53 14.59,36.6 J1.3
SDA  (via drill 0.25)
  Top 0.254: U1.20 30.71,31.78 v30.93,31.56
  Bottom 0.2: v30.93,31.56 30.44,32.05 29.79,32.05 29.61,31.88 19.81,31.88 17.53,34.16 17.53,36.12 14.05,39.6 J1.4
STAT1
  Top 0.254: R39.2 33.91,45.34 33.66,45.09 33.66,41.78 32.66,40.78 31.49,40.78 31.21,40.51 U1.35
STAT2
  Top 0.254: U1.34 33.55,40.16 34.71,41.31 R38.2
SW
  pour Top (no thermals): 61.85,60.58 61.85,62.62 61.6,62.87 59.94,62.87 59.69,62.62 59.69,59.56 59.94,59.31 62.74,59.31 62.87,59.44 62.87,60.07 62.74,60.2 62.23,60.2
TX1  (via drill 0.25)
  Top 0.2: v20.7,5.73 20.7,4.87 20.4,4.57 19.98,4.57 17.75,6.81 6.02,6.81 4.68,8.15 4.68,26.77 8.74,30.83 9.91,30.83 10.99,31.92 24.22,31.92 24.51,32.21 24.51,34.54 25.3,35.33 U1.9
  Bottom 0.2: U4.31 20.98,5.73 v20.7,5.73
TX2  (via drill 0.25)
  Top 0.2: v20.7,19.82 20.7,18.97 20.4,18.67 18.79,18.67 13.53,23.93 12.17,23.93 11.67,24.43 11.67,28.67 14.21,31.21 24.51,31.21 25.89,32.59 U1.11
  Bottom 0.2: U7.31 20.98,19.82 v20.7,19.82

### Text on the board
tDocu: ON | PG | RP | PWR | To Sensor | OFF | ON | CSR Select | OFF | Project Corvus / Display - v0.0 / Bobby Schulz | 7 | 6 | 5 | 4 | 3 | 2 | 1 | 0 | HOLD | Voltage | DISPB | Current | SEL0 | SEL1 | DISP B | Voltage | DISPA | DISP A | Current | SEL0 | SEL1